# Altium project jetson_xavier_nx_board.PrjPcb (part 1 of 2)
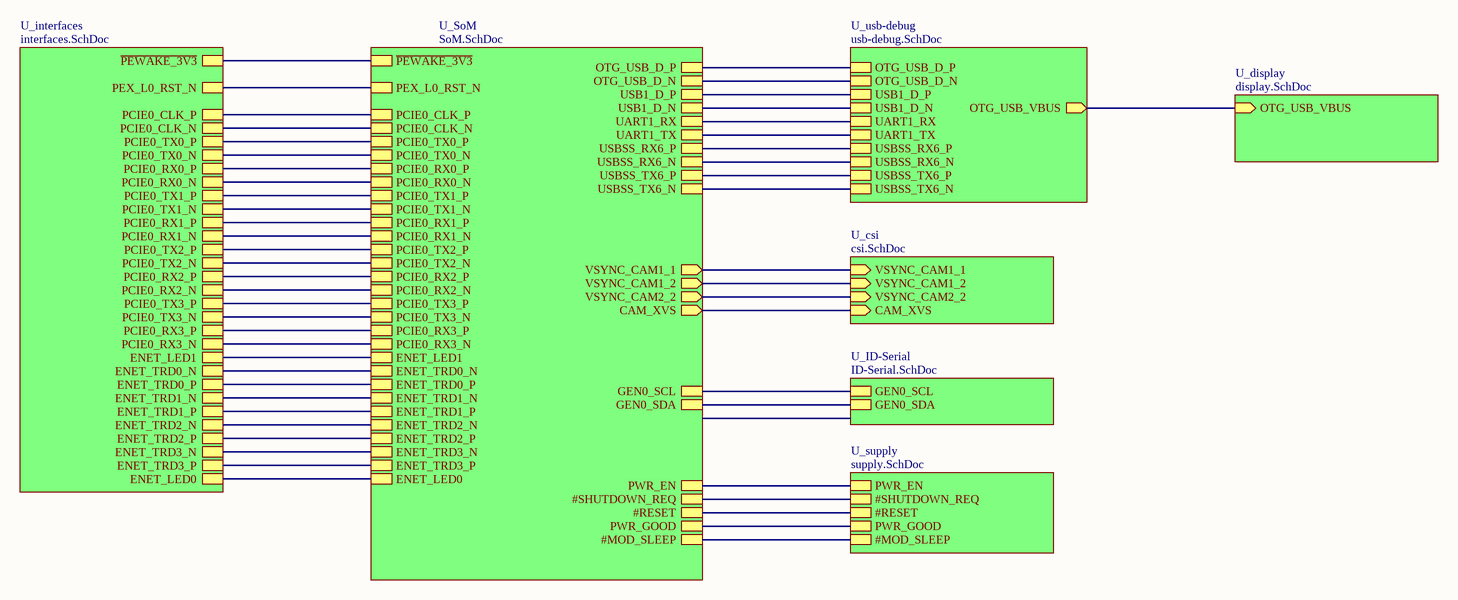
[diagram p0: top_sheet.SchDoc]
AM_Revision: 1.3; AM_Status: OSHW; AM_Title: Jetson Nano Baseboard
8 sheets, 347 parts. Net scope: hierarchical (ports join the sheet entries above them; power ports are global).
Board file: jetson_xavier_nx_board.PcbDoc
Sheets:
  top_sheet.SchDoc
    U_csi = csi.SchDoc
    U_ID-Serial = ID-Serial.SchDoc
    U_interfaces = interfaces.SchDoc
    U_SoM = SoM.SchDoc
    U_supply = supply.SchDoc
    U_usb-debug = usb-debug.SchDoc
    U_display = display.SchDoc

## Sheet top_sheet.SchDoc: Jetson Xavier NX Board
size A3; PageSetup: Record=PageOptions|CenterHorizontal=True|CenterVertical=True|PrintScale=0.97|XCorrection=1.00|YCorrection=1.00|PrintKind=1|BorderSize=5000000|LeftOffset=0|BottomOffset=0|Orientation=2|PaperLength=2970|PaperWidth=2100|Scale=100|PaperSource=7|PrintQuality=600|MediaType=1|DitherType=10|PaperKind=A4|PrintScaleMode=1; Organization: Altium Limited; Address1: 3 Minna Close; Address2: Belrose; Address3: NSW 2085; Address4: Australia; Revision: Rev01

### Sub-sheets
U_csi = csi.SchDoc: VSYNC_CAM1_1 (in), VSYNC_CAM1_2 (in), VSYNC_CAM2_2 (in), CAM_XVS (in)
U_display = display.SchDoc: OTG_USB_VBUS (in)
U_ID-Serial = ID-Serial.SchDoc: GEN0_SCL, GEN0_SDA
U_interfaces = interfaces.SchDoc: ~{PEWAKE_3V3}, PEX_L0_RST_N, PCIE0_CLK_P, PCIE0_CLK_N, PCIE0_TX0_P, PCIE0_TX0_N, PCIE0_RX0_P, PCIE0_RX0_N, PCIE0_TX1_P, PCIE0_TX1_N, PCIE0_RX1_P, PCIE0_RX1_N, PCIE0_TX2_P, PCIE0_TX2_N, PCIE0_RX2_P, PCIE0_RX2_N, PCIE0_TX3_P, PCIE0_TX3_N, PCIE0_RX3_P, PCIE0_RX3_N, ENET_LED1, ENET_TRD0_N, ENET_TRD0_P, ENET_TRD1_N, ENET_TRD1_P, ENET_TRD2_N, ENET_TRD2_P, ENET_TRD3_N, ENET_TRD3_P, ENET_LED0
U_SoM = SoM.SchDoc: VSYNC_CAM1_1 (out), VSYNC_CAM1_2 (out), VSYNC_CAM2_2 (out), ~{PEWAKE_3V3}, PEX_L0_RST_N, PCIE0_CLK_P, PCIE0_CLK_N, PCIE0_TX0_P, PCIE0_TX0_N, PCIE0_RX0_P, PCIE0_RX0_N, PCIE0_TX1_P, PCIE0_TX1_N, PCIE0_RX1_P, PCIE0_RX1_N, PCIE0_TX2_P, PCIE0_TX2_N, PCIE0_RX2_P, PCIE0_RX2_N, PCIE0_TX3_P, PCIE0_TX3_N, PCIE0_RX3_P, PCIE0_RX3_N, ENET_LED1, ENET_TRD0_N, ENET_TRD0_P, ENET_TRD1_N, ENET_TRD1_P, ENET_TRD2_N, ENET_TRD2_P, ENET_TRD3_N, ENET_TRD3_P, ENET_LED0, UART1_TX, UART1_RX, PWR_EN, #SHUTDOWN_REQ, #RESET, PWR_GOOD, USBSS_TX6_N, USBSS_TX6_P, USBSS_RX6_N, USBSS_RX6_P, #MOD_SLEEP, OTG_USB_D_N, OTG_USB_D_P, USB1_D_N, USB1_D_P, GEN0_SCL, GEN0_SDA, CAM_XVS (out)
U_supply = supply.SchDoc: PWR_EN, #SHUTDOWN_REQ, #RESET, PWR_GOOD, #MOD_SLEEP
U_usb-debug = usb-debug.SchDoc: OTG_USB_VBUS (out), USBSS_TX6_N, USBSS_TX6_P, USBSS_RX6_N, USBSS_RX6_P, UART1_TX, UART1_RX, OTG_USB_D_N, OTG_USB_D_P, USB1_D_N, USB1_D_P

### Nets
#MOD_SLEEP: sheet U_SoM/#MOD_SLEEP, sheet U_supply/#MOD_SLEEP
#RESET: sheet U_SoM/#RESET, sheet U_supply/#RESET
#SHUTDOWN_REQ: sheet U_SoM/#SHUTDOWN_REQ, sheet U_supply/#SHUTDOWN_REQ
~{PEWAKE_3V3}: sheet U_interfaces/~{PEWAKE_3V3}, sheet U_SoM/~{PEWAKE_3V3}
CAM_XVS: sheet U_csi/CAM_XVS, sheet U_SoM/CAM_XVS
ENET_LED0: sheet U_interfaces/ENET_LED0, sheet U_SoM/ENET_LED0
ENET_LED1: sheet U_interfaces/ENET_LED1, sheet U_SoM/ENET_LED1
ENET_TRD0_N: sheet U_interfaces/ENET_TRD0_N, sheet U_SoM/ENET_TRD0_N
ENET_TRD0_P: sheet U_interfaces/ENET_TRD0_P, sheet U_SoM/ENET_TRD0_P
ENET_TRD1_N: sheet U_interfaces/ENET_TRD1_N, sheet U_SoM/ENET_TRD1_N
ENET_TRD1_P: sheet U_interfaces/ENET_TRD1_P, sheet U_SoM/ENET_TRD1_P
ENET_TRD2_N: sheet U_interfaces/ENET_TRD2_N, sheet U_SoM/ENET_TRD2_N
ENET_TRD2_P: sheet U_interfaces/ENET_TRD2_P, sheet U_SoM/ENET_TRD2_P
ENET_TRD3_N: sheet U_interfaces/ENET_TRD3_N, sheet U_SoM/ENET_TRD3_N
ENET_TRD3_P: sheet U_interfaces/ENET_TRD3_P, sheet U_SoM/ENET_TRD3_P
GEN0_SCL: sheet U_ID-Serial/GEN0_SCL, sheet U_SoM/GEN0_SCL
GEN0_SDA: sheet U_ID-Serial/GEN0_SDA, sheet U_SoM/GEN0_SDA
OTG_USB_D_N: sheet U_SoM/OTG_USB_D_N, sheet U_usb-debug/OTG_USB_D_N
OTG_USB_D_P: sheet U_SoM/OTG_USB_D_P, sheet U_usb-debug/OTG_USB_D_P
OTG_USB_VBUS: sheet U_usb-debug/OTG_USB_VBUS, sheet U_display/OTG_USB_VBUS
PCIE0_CLK_N: sheet U_interfaces/PCIE0_CLK_N, sheet U_SoM/PCIE0_CLK_N
PCIE0_CLK_P: sheet U_interfaces/PCIE0_CLK_P, sheet U_SoM/PCIE0_CLK_P
PCIE0_RX0_N: sheet U_interfaces/PCIE0_RX0_N, sheet U_SoM/PCIE0_RX0_N
PCIE0_RX0_P: sheet U_interfaces/PCIE0_RX0_P, sheet U_SoM/PCIE0_RX0_P
PCIE0_RX1_N: sheet U_interfaces/PCIE0_RX1_N, sheet U_SoM/PCIE0_RX1_N
PCIE0_RX1_P: sheet U_interfaces/PCIE0_RX1_P, sheet U_SoM/PCIE0_RX1_P
PCIE0_RX2_N: sheet U_interfaces/PCIE0_RX2_N, sheet U_SoM/PCIE0_RX2_N
PCIE0_RX2_P: sheet U_interfaces/PCIE0_RX2_P, sheet U_SoM/PCIE0_RX2_P
PCIE0_RX3_N: sheet U_interfaces/PCIE0_RX3_N, sheet U_SoM/PCIE0_RX3_N
PCIE0_RX3_P: sheet U_interfaces/PCIE0_RX3_P, sheet U_SoM/PCIE0_RX3_P
PCIE0_TX0_N: sheet U_interfaces/PCIE0_TX0_N, sheet U_SoM/PCIE0_TX0_N
PCIE0_TX0_P: sheet U_interfaces/PCIE0_TX0_P, sheet U_SoM/PCIE0_TX0_P
PCIE0_TX1_N: sheet U_interfaces/PCIE0_TX1_N, sheet U_SoM/PCIE0_TX1_N
PCIE0_TX1_P: sheet U_interfaces/PCIE0_TX1_P, sheet U_SoM/PCIE0_TX1_P
PCIE0_TX2_N: sheet U_interfaces/PCIE0_TX2_N, sheet U_SoM/PCIE0_TX2_N
PCIE0_TX2_P: sheet U_interfaces/PCIE0_TX2_P, sheet U_SoM/PCIE0_TX2_P
PCIE0_TX3_N: sheet U_interfaces/PCIE0_TX3_N, sheet U_SoM/PCIE0_TX3_N
PCIE0_TX3_P: sheet U_interfaces/PCIE0_TX3_P, sheet U_SoM/PCIE0_TX3_P
PEX_L0_RST_N: sheet U_interfaces/PEX_L0_RST_N, sheet U_SoM/PEX_L0_RST_N
PWR_EN: sheet U_SoM/PWR_EN, sheet U_supply/PWR_EN
PWR_GOOD: sheet U_SoM/PWR_GOOD, sheet U_supply/PWR_GOOD
UART1_RX: sheet U_SoM/UART1_RX, sheet U_usb-debug/UART1_RX
UART1_TX: sheet U_SoM/UART1_TX, sheet U_usb-debug/UART1_TX
USB1_D_N: sheet U_SoM/USB1_D_N, sheet U_usb-debug/USB1_D_N
USB1_D_P: sheet U_SoM/USB1_D_P, sheet U_usb-debug/USB1_D_P
USBSS_RX6_N: sheet U_SoM/USBSS_RX6_N, sheet U_usb-debug/USBSS_RX6_N
USBSS_RX6_P: sheet U_SoM/USBSS_RX6_P, sheet U_usb-debug/USBSS_RX6_P
USBSS_TX6_N: sheet U_SoM/USBSS_TX6_N, sheet U_usb-debug/USBSS_TX6_N
USBSS_TX6_P: sheet U_SoM/USBSS_TX6_P, sheet U_usb-debug/USBSS_TX6_P
VSYNC_CAM1_1: sheet U_csi/VSYNC_CAM1_1, sheet U_SoM/VSYNC_CAM1_1
VSYNC_CAM1_2: sheet U_csi/VSYNC_CAM1_2, sheet U_SoM/VSYNC_CAM1_2
VSYNC_CAM2_2: sheet U_csi/VSYNC_CAM2_2, sheet U_SoM/VSYNC_CAM2_2

### Notes on the sheet
- Title
- Size:
- Date:
- A3
- Number:
- Time:
- Revision:
- Sheet
- of
- Go360.io
- File:

## Sheet csi.SchDoc: Jetson Xavier NX Board
size A3; PageSetup: Record=PageOptions|CenterHorizontal=True|CenterVertical=True|PrintScale=0.97|XCorrection=1.00|YCorrection=1.00|PrintKind=1|BorderSize=5000000|LeftOffset=0|BottomOffset=0|Orientation=2|PaperLength=2970|PaperWidth=2100|Scale=100|PaperSource=7|PrintQuality=600|MediaType=1|DitherType=10|PaperKind=A4|PrintScaleMode=1; Organization: Altium Limited; Address1: 3 Minna Close; Address2: Belrose; Address3: NSW 2085; Address4: Australia; Revision: Rev01
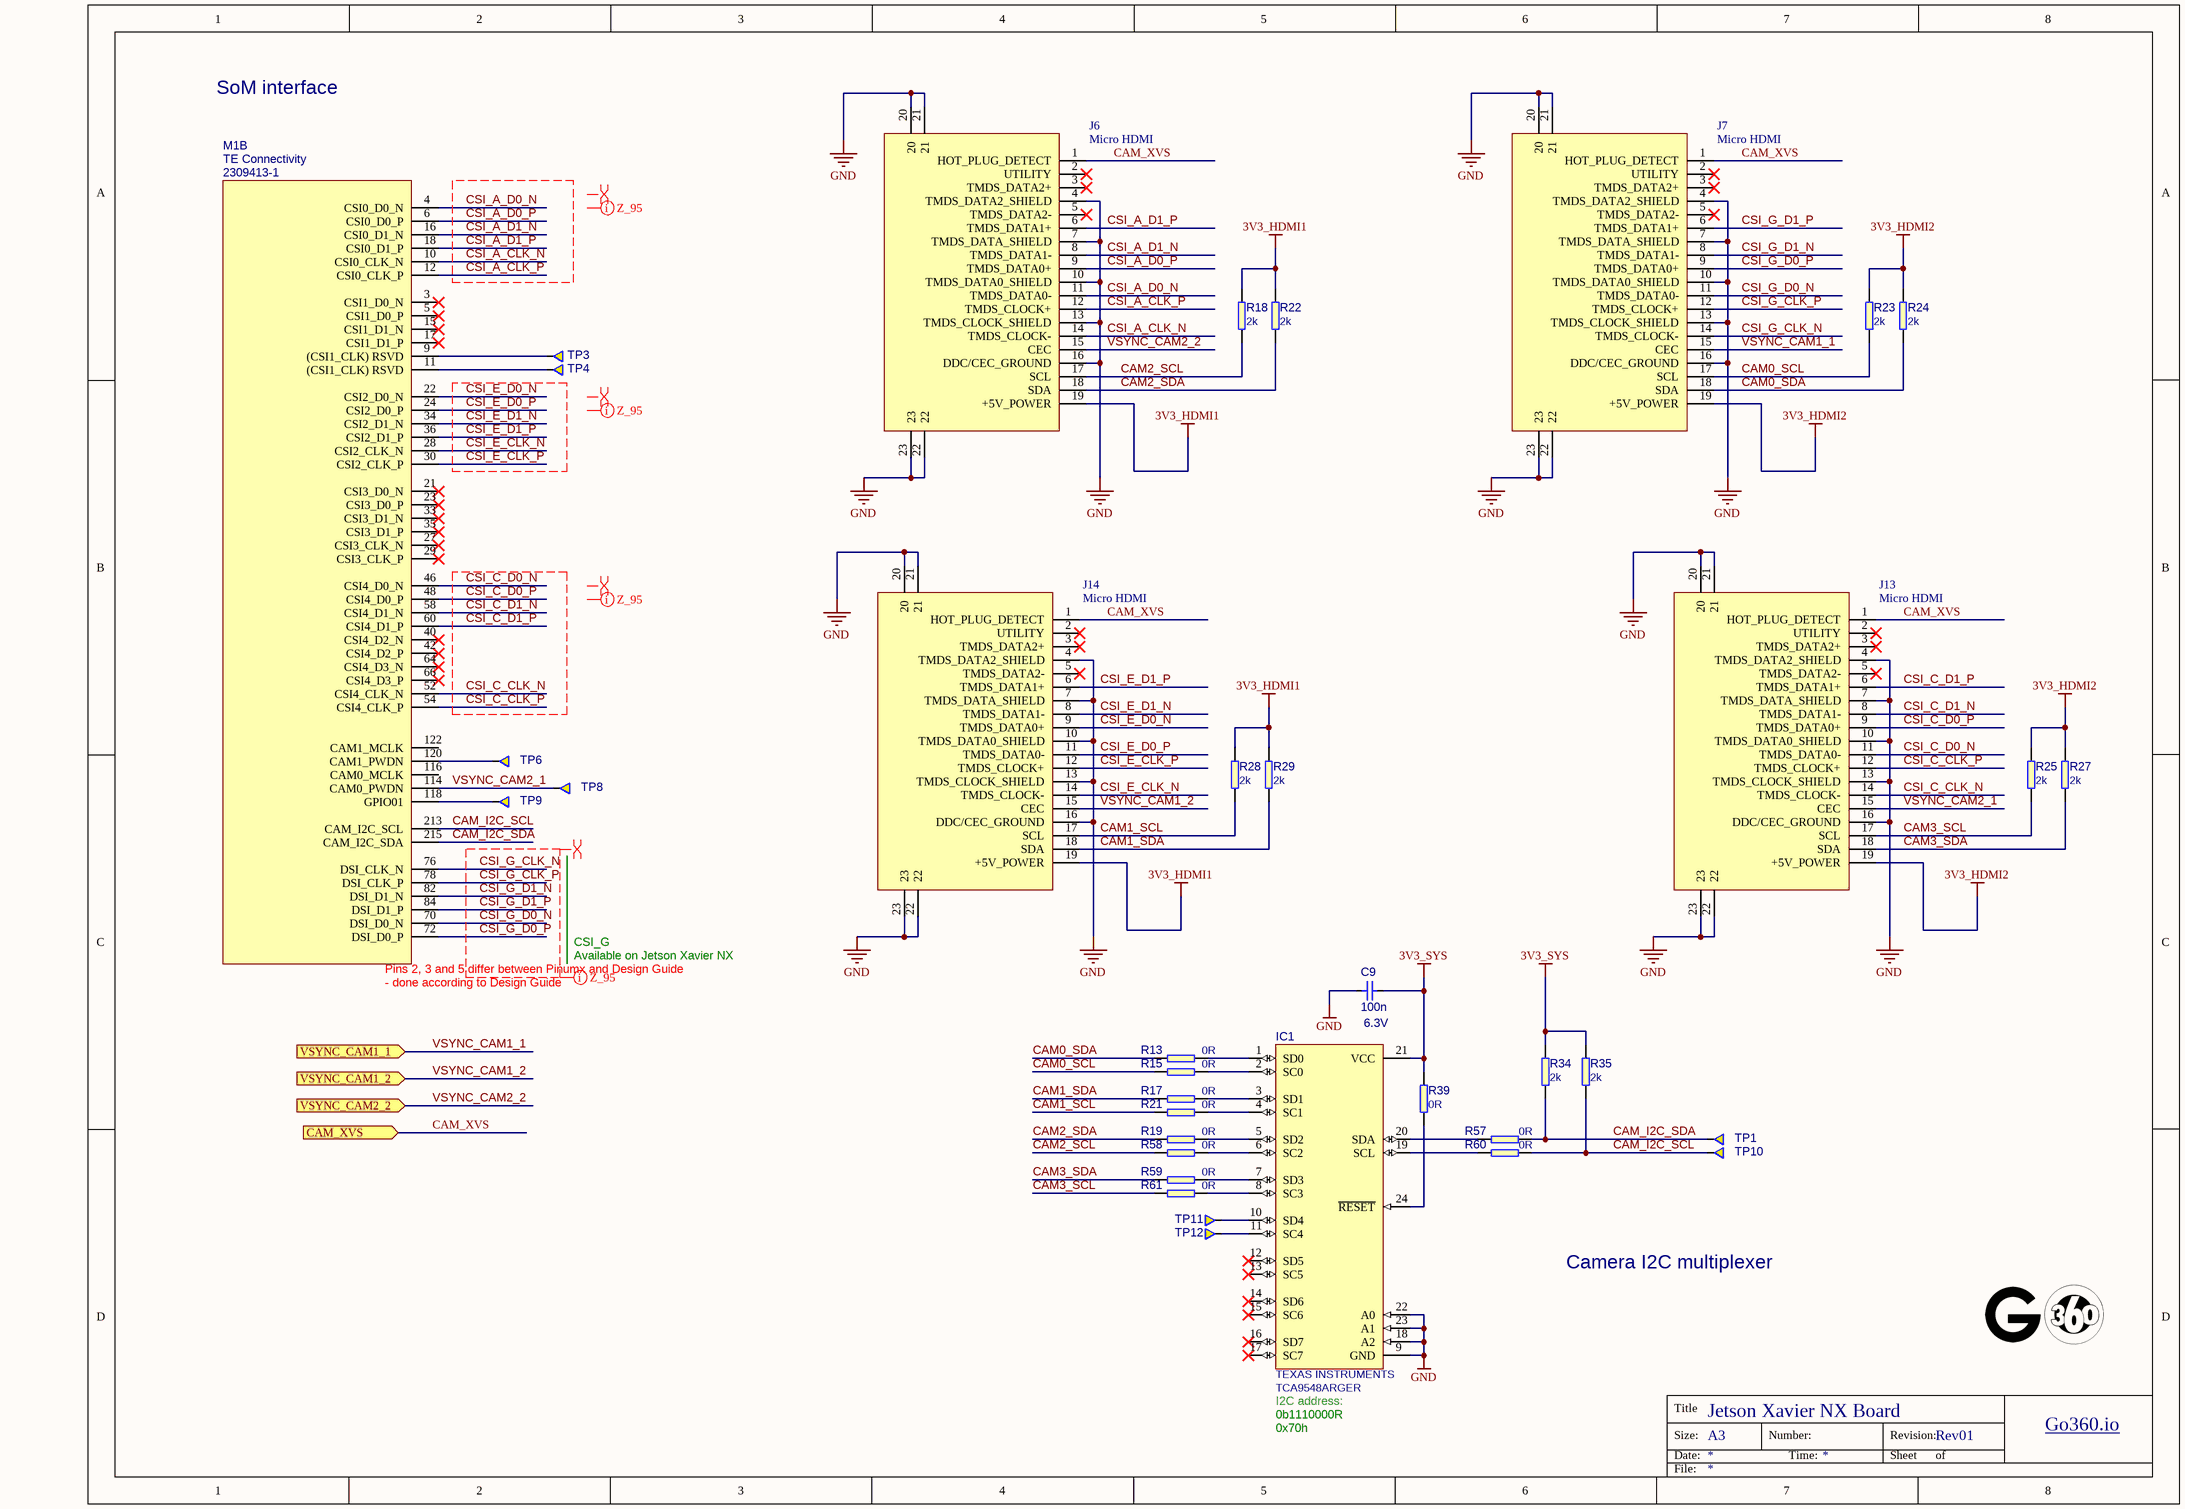
[diagram p1: csi.SchDoc]

### Parts
(Parts that share a designator on the sheet are numbered #1, #2 ... from top to bottom, then left to right.)
C9  Voltage: 6.3V  [0402]  (hidden comment: 100n)
IC1  TCA9548ARGER  Manufacturer: TEXAS INSTRUMENTS  [VQFN-24]
J6  Micro HDMI  [HDMI-0467650301]
J7  Micro HDMI  [HDMI-0467650301]
J13  Micro HDMI  [HDMI-0467650301]
J14  Micro HDMI  [HDMI-0467650301]
M1#1  Manufacturer: TE Connectivity  [jetson-nano-connector]  (hidden comment: 2309413-1)  (part B of 7)
R13  0R  [0402]
R15  0R  [0402]
R17  0R  [0402]
R18  2k  [0402]
R19  0R  [0402]
R21  0R  [0402]
R22  2k  [0402]
R23  2k  [0402]
R24  2k  [0402]
R25  2k  [0402]
R27  2k  [0402]
R28  2k  [0402]
R29  2k  [0402]
R34  2k  [0402]
R35  2k  [0402]
R39  0R  [0402]
R57  0R  [0402]
R58  0R  [0402]
R59  0R  [0402]
R60  0R  [0402]
R61  0R  [0402]
TP1  Testpad  [TP-R-1.5]  (value not drawn)  (no BOM)
TP3  Testpad  [TP-R-1.5]  (value not drawn)  (no BOM)
TP4  Testpad  [TP-R-1.5]  (value not drawn)  (no BOM)
TP6  Testpad  [TP-R-1.5]  (value not drawn)  (no BOM)
TP8  Testpad  [TP-R-1.5]  (value not drawn)  (no BOM)
TP9  Testpad  [TP-R-1.5]  (value not drawn)  (no BOM)
TP10  Testpad  [TP-R-1.5]  (value not drawn)  (no BOM)
TP11  Testpad  [TP-R-1.5]  (value not drawn)  (no BOM)
TP12  Testpad  [TP-R-1.5]  (value not drawn)  (no BOM)

### Ports
CAM_XVS (in), VSYNC_CAM1_1 (in), VSYNC_CAM1_2 (in), VSYNC_CAM2_2 (in)

### Nets
3V3_HDMI1: J6.19(+5V_POWER) J14.19(+5V_POWER) R18.1 R22.1 R28.1 R29.1
3V3_HDMI2: J7.19(+5V_POWER) J13.19(+5V_POWER) R23.1 R24.1 R25.1 R27.1
3V3_SYS: C9.2 IC1.21(VCC) R34.1 R35.1 R39.2
GND: C9.1 IC1.9(GND) IC1.18(A2) IC1.22(A0) IC1.23(A1) J6.4(TMDS_DATA2_SHIELD) J6.7(TMDS_DATA_SHIELD) J6.10(TMDS_DATA0_SHIELD) J6.13(TMDS_CLOCK_SHIELD) J6.16(DDC/CEC_GROUND) J6.20 J6.21 J6.22 J6.23 J7.4(TMDS_DATA2_SHIELD) J7.7(TMDS_DATA_SHIELD) J7.10(TMDS_DATA0_SHIELD) J7.13(TMDS_CLOCK_SHIELD) J7.16(DDC/CEC_GROUND) J7.20 J7.21 J7.22 J7.23 J13.4(TMDS_DATA2_SHIELD) J13.7(TMDS_DATA_SHIELD) J13.10(TMDS_DATA0_SHIELD) J13.13(TMDS_CLOCK_SHIELD) J13.16(DDC/CEC_GROUND) J13.20 J13.21 J13.22 J13.23 J14.4(TMDS_DATA2_SHIELD) J14.7(TMDS_DATA_SHIELD) J14.10(TMDS_DATA0_SHIELD) J14.13(TMDS_CLOCK_SHIELD) J14.16(DDC/CEC_GROUND) J14.20 J14.21 J14.22 J14.23
CAM0_SCL: J7.17(SCL) R15.1 R23.2
CAM0_SDA: J7.18(SDA) R13.1 R24.2
CAM1_SCL: J14.17(SCL) R21.1 R28.2
CAM1_SDA: J14.18(SDA) R17.1 R29.2
CAM2_SCL: J6.17(SCL) R18.2 R58.1
CAM2_SDA: J6.18(SDA) R19.1 R22.2
CAM3_SCL: J13.17(SCL) R25.2 R61.1
CAM3_SDA: J13.18(SDA) R27.2 R59.1
CAM_I2C_SCL: M1#1.213(CAM_I2C_SCL) R35.2 R60.2 TP10.1
CAM_I2C_SDA: M1#1.215(CAM_I2C_SDA) R34.2 R57.2 TP1.1
CAM_XVS: J6.1(HOT_PLUG_DETECT) J7.1(HOT_PLUG_DETECT) J13.1(HOT_PLUG_DETECT) J14.1(HOT_PLUG_DETECT) ; port CAM_XVS
CSI_A_CLK_N: J6.14(TMDS_CLOCK-) M1#1.10(CSI0_CLK_N)
CSI_A_CLK_P: J6.12(TMDS_CLOCK+) M1#1.12(CSI0_CLK_P)
CSI_A_D0_N: J6.11(TMDS_DATA0-) M1#1.4(CSI0_D0_N)
CSI_A_D0_P: J6.9(TMDS_DATA0+) M1#1.6(CSI0_D0_P)
CSI_A_D1_N: J6.8(TMDS_DATA1-) M1#1.16(CSI0_D1_N)
CSI_A_D1_P: J6.6(TMDS_DATA1+) M1#1.18(CSI0_D1_P)
CSI_C_CLK_N: J13.14(TMDS_CLOCK-) M1#1.52(CSI4_CLK_N)
CSI_C_CLK_P: J13.12(TMDS_CLOCK+) M1#1.54(CSI4_CLK_P)
CSI_C_D0_N: J13.11(TMDS_DATA0-) M1#1.46(CSI4_D0_N)
CSI_C_D0_P: J13.9(TMDS_DATA0+) M1#1.48(CSI4_D0_P)
CSI_C_D1_N: J13.8(TMDS_DATA1-) M1#1.58(CSI4_D1_N)
CSI_C_D1_P: J13.6(TMDS_DATA1+) M1#1.60(CSI4_D1_P)
CSI_E_CLK_N: J14.14(TMDS_CLOCK-) M1#1.28(CSI2_CLK_N)
CSI_E_CLK_P: J14.12(TMDS_CLOCK+) M1#1.30(CSI2_CLK_P)
CSI_E_D0_N: J14.9(TMDS_DATA0+) M1#1.22(CSI2_D0_N)
CSI_E_D0_P: J14.11(TMDS_DATA0-) M1#1.24(CSI2_D0_P)
CSI_E_D1_N: J14.8(TMDS_DATA1-) M1#1.34(CSI2_D1_N)
CSI_E_D1_P: J14.6(TMDS_DATA1+) M1#1.36(CSI2_D1_P)
CSI_G_CLK_N: J7.14(TMDS_CLOCK-) M1#1.76(DSI_CLK_N)
CSI_G_CLK_P: J7.12(TMDS_CLOCK+) M1#1.78(DSI_CLK_P)
CSI_G_D0_N: J7.11(TMDS_DATA0-) M1#1.70(DSI_D0_N)
CSI_G_D0_P: J7.9(TMDS_DATA0+) M1#1.72(DSI_D0_P)
CSI_G_D1_N: J7.8(TMDS_DATA1-) M1#1.82(DSI_D1_N)
CSI_G_D1_P: J7.6(TMDS_DATA1+) M1#1.84(DSI_D1_P)
VSYNC_CAM1_1: J7.15(CEC) ; port VSYNC_CAM1_1
VSYNC_CAM1_2: J14.15(CEC) ; port VSYNC_CAM1_2
VSYNC_CAM2_1: J13.15(CEC) M1#1.114(CAM0_PWDN) TP8.1
VSYNC_CAM2_2: J6.15(CEC) ; port VSYNC_CAM2_2
NetIC1_1: IC1.1(SD0) R13.2
NetIC1_2: IC1.2(SC0) R15.2
NetIC1_3: IC1.3(SD1) R17.2
NetIC1_4: IC1.4(SC1) R21.2
NetIC1_5: IC1.5(SD2) R19.2
NetIC1_6: IC1.6(SC2) R58.2
NetIC1_7: IC1.7(SD3) R59.2
NetIC1_8: IC1.8(SC3) R61.2
NetIC1_10: IC1.10(SD4) TP11.1
NetIC1_11: IC1.11(SC4) TP12.1
NetIC1_19: IC1.19(SCL) R60.1
NetIC1_20: IC1.20(SDA) R57.1
NetIC1_24: IC1.24(~{RESET}) R39.1
NetM1#1_9: M1#1.9((CSI1_CLK)_RSVD) TP3.1
NetM1#1_11: M1#1.11((CSI1_CLK)_RSVD) TP4.1
NetM1#1_118: M1#1.118(GPIO01) TP9.1
NetM1#1_120: M1#1.120(CAM1_PWDN) TP6.1

Not connected (* = marked no-connect by the designer): IC1 12(SD5)* 13(SC5)* 14(SD6)* 15(SC6)* 16(SD7)* 17(SC7)*; J6 2(UTILITY)* 3(TMDS_DATA2+)* 5(TMDS_DATA2-)*; J7 2(UTILITY)* 3(TMDS_DATA2+)* 5(TMDS_DATA2-)*; J13 2(UTILITY)* 3(TMDS_DATA2+)* 5(TMDS_DATA2-)*; J14 2(UTILITY)* 3(TMDS_DATA2+)* 5(TMDS_DATA2-)*; M1#1 3(CSI1_D0_N)* 5(CSI1_D0_P)* 15(CSI1_D1_N)* 17(CSI1_D1_P)* 21(CSI3_D0_N)* 23(CSI3_D0_P)* 27(CSI3_CLK_N)* 29(CSI3_CLK_P)* 33(CSI3_D1_N)* 35(CSI3_D1_P)* 40(CSI4_D2_N)* 42(CSI4_D2_P)* 64(CSI4_D3_N)* 66(CSI4_D3_P)* 116(CAM0_MCLK) 122(CAM1_MCLK)

### Layout directives
differential pair: (no net found under the mark), CSI_G_CLK_N, CSI_G_CLK_P, CSI_G_D0_N, CSI_G_D0_P, CSI_G_D1_N, CSI_G_D1_P
net class Z_95: (no net found under the mark), CSI_G_CLK_N, CSI_G_CLK_P, CSI_G_D0_N, CSI_G_D0_P, CSI_G_D1_N, CSI_G_D1_P

### Notes on the sheet
- SoM interface
- CSI_G
- Available on Jetson Xavier NX
- Camera I2C multiplexer
- 0x70h
- 0b1110000R
- (near IC1) I2C address:
- Title
- Size:
- Date:
- A3
- Number:
- Time:
- Revision:
- Sheet
- of
- Go360.io
- File:
- (in symbol jetson-nano-new-release, part B) Pins 2, 3 and 5 differ between Pinumx and Design Guide; - done according to Design Guide

### Library data of the parts
C9 = C_100n_0402: MLCC SMT Capacitor 100n 0402; Manufacturer: TDK; PartSymbol: C1005X5R0J104K050BA; Value: 100n; PartNumber: C_100n_0402
IC1 = TCA9548A: TCA9548ARGER  I2C SWITCH W/ RESET, 8-CH, VQFN-24; Value: TCA9548ARGER; PartNumber: TCA9548ARGER; PartSymbol: TCA9548ARGER
J6 J7 J13 J14 = HDMI-0467650301
M1#1 = jetson-nano-new-release: PartNumber: 2309413-1; PartSymbol: 2309413-1; Value: 2309413-1
R13 R15 R17 R19 R21 R39 R57-R61 = R_0R_0402: RES, 0R, 0402; Manufacturer: Panasonic; PartSymbol: ERJ2GE0R00X; Value: 0R; PartNumber: R_0R_0402
R18 R22-R25 R27-R29 R34 R35 = R_2k_0402: RES, 2k, 0402; Manufacturer: VISHAY; PartSymbol: CRCW04022K00FKED; PartNumber: R_2k_0402; Value: 2k
TP1 TP3 TP4 TP6 TP8-TP12 = Testpad: Testpad, round, 1.5mm; PartNumber: TP-R-1.5

## Sheet ID-Serial.SchDoc: Jetson Xavier NX Board
size A3; PageSetup: Record=PageOptions|CenterHorizontal=True|CenterVertical=True|PrintScale=0.97|XCorrection=1.00|YCorrection=1.00|PrintKind=1|BorderSize=5000000|LeftOffset=0|BottomOffset=0|Orientation=2|PaperLength=2970|PaperWidth=2100|Scale=100|PaperSource=7|PrintQuality=600|MediaType=1|DitherType=10|PaperKind=A4|PrintScaleMode=1; Organization: Altium Limited; Address1: 3 Minna Close; Address2: Belrose; Address3: NSW 2085; Address4: Australia; Revision: Rev01
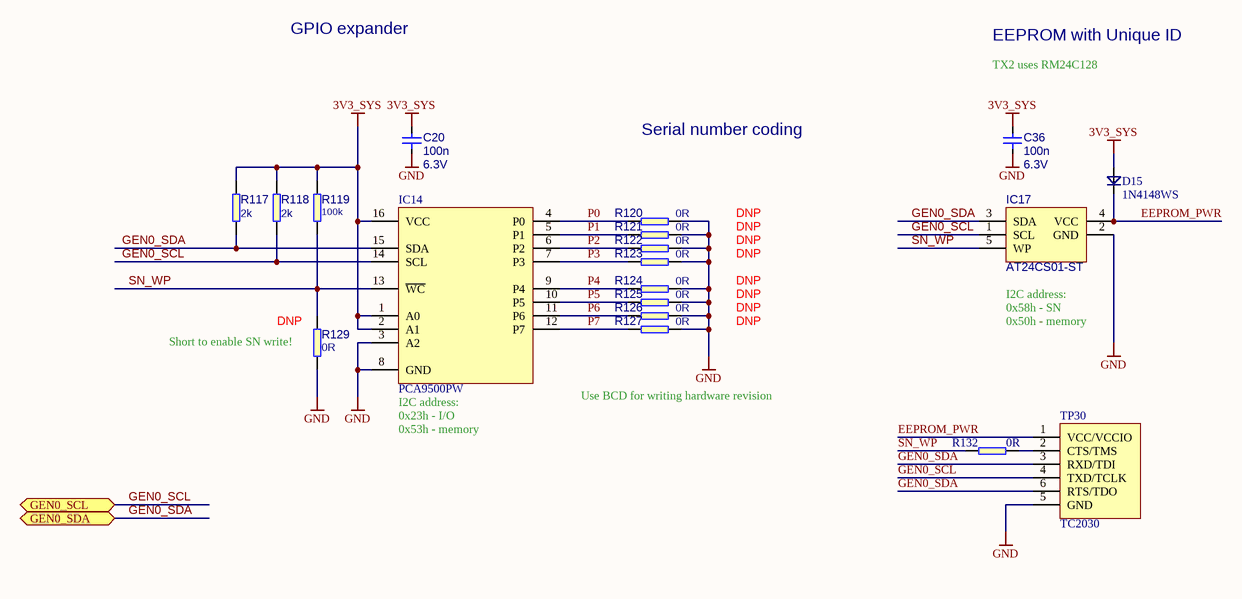
[diagram p2: ID-Serial.SchDoc]

### Parts
C20  Voltage: 6.3V  [0402]  (hidden comment: 100n)
C36  Voltage: 6.3V  [0402]  (hidden comment: 100n)
D15  1N4148WS  [SOD-323]
IC14  PCA9500PW  [TSSOP-16]
IC17  AT24CS01-ST  [SOT23-5]
R117  2k  [0402]
R118  2k  [0402]
R119  100k  [0402]
R120  0R  [0402]
R121  0R  [0402]
R122  0R  [0402]
R123  0R  [0402]
R124  0R  [0402]
R125  0R  [0402]
R126  0R  [0402]
R127  0R  [0402]
R129  0R  [0402]
R132  0R  [0402]
TP30  TC2030  [TC2030]  (no BOM)

### Ports
GEN0_SCL, GEN0_SDA

### Nets
3V3_SYS: C20.2 C36.2 D15.A IC14.1(A0) IC14.2(A1) IC14.16(VCC) R117.1 R118.1 R119.1
GND: C20.1 C36.1 IC14.3(A2) IC14.8(GND) IC17.2(GND) R120.2 R121.2 R122.2 R123.2 R124.2 R125.2 R126.2 R127.2 R129.1 TP30.5(GND)
EEPROM_PWR: D15.C IC17.4(VCC) TP30.1(VCC/VCCIO)
GEN0_SCL: IC14.14(SCL) IC17.1(SCL) R118.2 TP30.4(TXD/TCLK) ; port GEN0_SCL
GEN0_SDA: IC14.15(SDA) IC17.3(SDA) R117.2 TP30.3(RXD/TDI) TP30.6(RTS/TDO) ; port GEN0_SDA
P0: IC14.4(P0) R120.1
P1: IC14.5(P1) R121.1
P2: IC14.6(P2) R122.1
P3: IC14.7(P3) R123.1
P4: IC14.9(P4) R124.1
P5: IC14.10(P5) R125.1
P6: IC14.11(P6) R126.1
P7: IC14.12(P7) R127.1
SN_WP: IC14.13(~{WC}) IC17.5(WP) R119.2 R129.2 R132.1
NetR132_2: R132.2 TP30.2(CTS/TMS)

### Notes on the sheet
- GPIO expander
- EEPROM with Unique ID
- TX2 uses RM24C128
- Serial number coding
- DNP
- (near IC17) I2C address:
- (near R129) Short to enable SN write!
- (near R129) DNP
- 0x58h - SN
- 0x50h - memory
- (near IC14) 0x23h - I/O
- (near IC14) I2C address:
- 0x53h - memory
- Use BCD for writing hardware revision
- Title
- Size:
- Date:
- A3
- Number:
- Time:
- Revision:
- Sheet
- of
- Go360.io
- File:

### Library data of the parts
C20 C36 = C_100n_0402: as C9 on sheet csi; Value: 100n; PartNumber: C_100n_0402
D15 = diode: Diode small signal; Manufacturer: ON SEMICONDUCTOR; PartNumber: 1N4148WS; Value: 1N4148WS; PartSymbol: 1N4148WS
IC14 = PCA9500PW: Remote 8bit I2C SMBus I/O expander w/ 2kbit EEPROM memory; Manufacturer: NXP Semicondutors; PartNumber: PCA9500PW; Value: PCA9500PW; PartSymbol: PCA9500PW
IC17 = AT24CS01: Manufacturer: Atmel; PartNumber: AT24CS01-ST; PartSymbol: AT24CS01-ST; Value: AT24CS01-ST
R117 R118 = R_2k_0402: as R18 on sheet csi; PartNumber: R_2k_0402; Value: 2k
R119 = R_100k_0402: SMT Resistor 100k 0402; Manufacturer: VISHAY; PartSymbol: CRCW0402100KFKEDHP; Tolerance: 1%; PartNumber: R_100k_0402; Value: 100k
R120-R127 R129 R132 = R_0R_0402: as R13 on sheet csi; PartNumber: R_0R_0402; Value: 0R
TP30 = TC2030: Manufacturer: Tag-Connect; PartNumber: TC2030; PartSymbol: TC2030; Value: TC2030

## Sheet interfaces.SchDoc: Jetson Xavier NX Board
size A3; PageSetup: Record=PageOptions|CenterHorizontal=True|CenterVertical=True|PrintScale=0.97|XCorrection=1.00|YCorrection=1.00|PrintKind=1|BorderSize=5000000|LeftOffset=0|BottomOffset=0|Orientation=2|PaperLength=2970|PaperWidth=2100|Scale=100|PaperSource=7|PrintQuality=600|MediaType=1|DitherType=10|PaperKind=A4|PrintScaleMode=1; Organization: Altium Limited; Address1: 3 Minna Close; Address2: Belrose; Address3: NSW 2085; Address4: Australia; Revision: Rev01
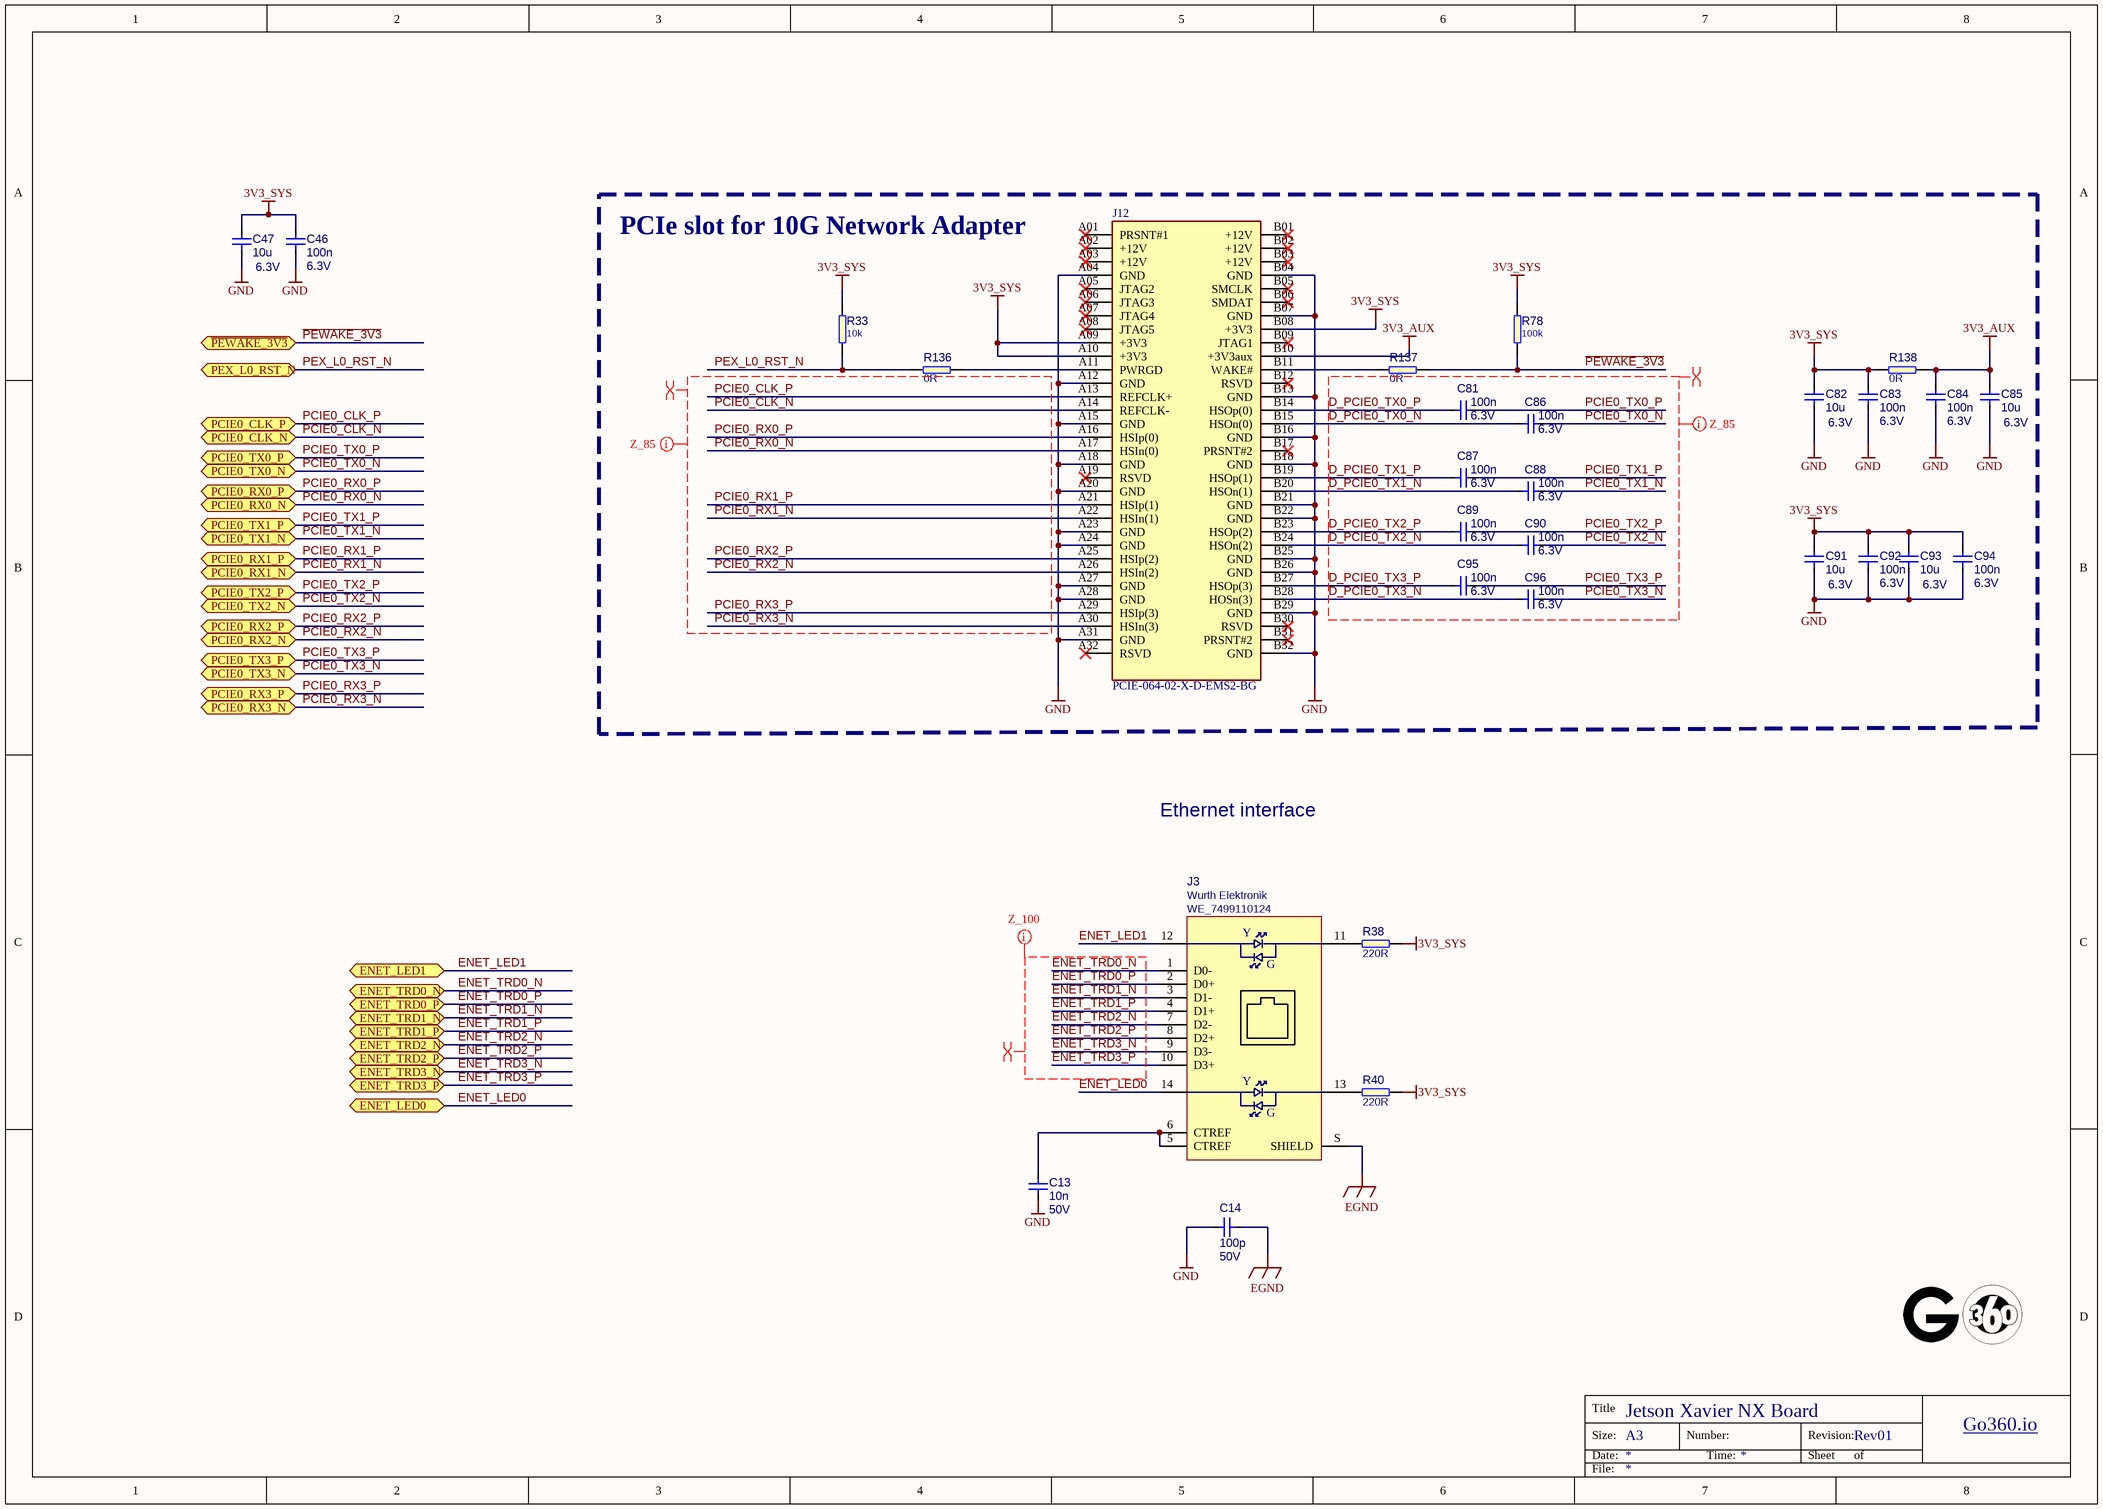
[diagram p3: interfaces.SchDoc]

### Parts
C13  Voltage: 50V  [0402]  (hidden comment: 10n)
C14  Voltage: 50V  [0805]  (hidden comment: 100p)
C46  Voltage: 6.3V  [0402]  (hidden comment: 100n)
C47  Voltage: 6.3V  [0603]  (hidden comment: 10u)
C81  Voltage: 6.3V  [0402]  (hidden comment: 100n)
C82  Voltage: 6.3V  [0603]  (hidden comment: 10u)
C83  Voltage: 6.3V  [0402]  (hidden comment: 100n)
C84  Voltage: 6.3V  [0402]  (hidden comment: 100n)
C85  Voltage: 6.3V  [0603]  (hidden comment: 10u)
C86  Voltage: 6.3V  [0402]  (hidden comment: 100n)
C87  Voltage: 6.3V  [0402]  (hidden comment: 100n)
C88  Voltage: 6.3V  [0402]  (hidden comment: 100n)
C89  Voltage: 6.3V  [0402]  (hidden comment: 100n)
C90  Voltage: 6.3V  [0402]  (hidden comment: 100n)
C91  Voltage: 6.3V  [0603]  (hidden comment: 10u)
C92  Voltage: 6.3V  [0402]  (hidden comment: 100n)
C93  Voltage: 6.3V  [0603]  (hidden comment: 10u)
C94  Voltage: 6.3V  [0402]  (hidden comment: 100n)
C95  Voltage: 6.3V  [0402]  (hidden comment: 100n)
C96  Voltage: 6.3V  [0402]  (hidden comment: 100n)
J3  Manufacturer: Wurth Elektronik  [WE_7499110124]  (hidden comment: WE_7499110124)
J12  PCIE-064-02-X-D-EMS2-BG  [SAMTEC_PCIE-064-02-X-D-EMS2-BG]
R33  10k  [0402]
R38  220R  [0402]
R40  220R  [0402]
R78  100k  [0402]
R136  0R  [0402]
R137  0R  [0402]
R138  0R  [0402]

### Blocks framed on the sheet
PCIe slot for 10G Network Adapter: C81-C96 J12 R33 R78 R136-R138

### Ports
ENET_LED0, ENET_LED1, ENET_TRD0_N, ENET_TRD0_P, ENET_TRD1_N, ENET_TRD1_P, ENET_TRD2_N, ENET_TRD2_P, ENET_TRD3_N, ENET_TRD3_P, PCIE0_CLK_N, PCIE0_CLK_P, PCIE0_RX0_N, PCIE0_RX0_P, PCIE0_RX1_N, PCIE0_RX1_P, PCIE0_RX2_N, PCIE0_RX2_P, PCIE0_RX3_N, PCIE0_RX3_P, PCIE0_TX0_N, PCIE0_TX0_P, PCIE0_TX1_N, PCIE0_TX1_P, PCIE0_TX2_N, PCIE0_TX2_P, PCIE0_TX3_N, PCIE0_TX3_P, PEX_L0_RST_N, ~{PEWAKE_3V3}

### Nets
3V3_AUX: C84.2 C85.2 J12.B10(+3V3aux) R138.1
3V3_SYS: C46.2 C47.2 C82.2 C83.2 C91.2 C92.2 C93.2 C94.2 J12.A09(+3V3) J12.A10(+3V3) J12.B08(+3V3) R33.1 R38.2 R40.1 R78.2 R138.2
EGND: C14.1 J3.S(SHIELD)
GND: C13.2 C14.2 C46.1 C47.1 C82.1 C83.1 C84.1 C85.1 C91.1 C92.1 C93.1 C94.1 J12.A04(GND) J12.A12(GND) J12.A15(GND) J12.A18(GND) J12.A20(GND) J12.A23(GND) J12.A24(GND) J12.A27(GND) J12.A28(GND) J12.A31(GND) J12.B04(GND) J12.B07(GND) J12.B13(GND) J12.B16(GND) J12.B18(GND) J12.B21(GND) J12.B22(GND) J12.B25(GND) J12.B26(GND) J12.B29(GND) J12.B32(GND)
~{PEWAKE_3V3}: R78.1 R137.1 ; port ~{PEWAKE_3V3}
D_PCIE0_TX0_N: C86.1 J12.B15(HSOn(0))
D_PCIE0_TX0_P: C81.1 J12.B14(HSOp(0))
D_PCIE0_TX1_N: C88.1 J12.B20(HSOn(1))
D_PCIE0_TX1_P: C87.1 J12.B19(HSOp(1))
D_PCIE0_TX2_N: C90.1 J12.B24(HSOn(2))
D_PCIE0_TX2_P: C89.1 J12.B23(HSOp(2))
D_PCIE0_TX3_N: C96.1 J12.B28(HOSn(3))
D_PCIE0_TX3_P: C95.1 J12.B27(HSOp(3))
ENET_LED0: J3.14 ; port ENET_LED0
ENET_LED1: J3.12 ; port ENET_LED1
ENET_TRD0_N: J3.1(D0-) ; port ENET_TRD0_N
ENET_TRD0_P: J3.2(D0+) ; port ENET_TRD0_P
ENET_TRD1_N: J3.3(D1-) ; port ENET_TRD1_N
ENET_TRD1_P: J3.4(D1+) ; port ENET_TRD1_P
ENET_TRD2_N: J3.7(D2-) ; port ENET_TRD2_N
ENET_TRD2_P: J3.8(D2+) ; port ENET_TRD2_P
ENET_TRD3_N: J3.9(D3-) ; port ENET_TRD3_N
ENET_TRD3_P: J3.10(D3+) ; port ENET_TRD3_P
PCIE0_CLK_N: J12.A14(REFCLK-) ; port PCIE0_CLK_N
PCIE0_CLK_P: J12.A13(REFCLK+) ; port PCIE0_CLK_P
PCIE0_RX0_N: J12.A17(HSIn(0)) ; port PCIE0_RX0_N
PCIE0_RX0_P: J12.A16(HSIp(0)) ; port PCIE0_RX0_P
PCIE0_RX1_N: J12.A22(HSIn(1)) ; port PCIE0_RX1_N
PCIE0_RX1_P: J12.A21(HSIp(1)) ; port PCIE0_RX1_P
PCIE0_RX2_N: J12.A26(HSIn(2)) ; port PCIE0_RX2_N
PCIE0_RX2_P: J12.A25(HSIp(2)) ; port PCIE0_RX2_P
PCIE0_RX3_N: J12.A30(HSIn(3)) ; port PCIE0_RX3_N
PCIE0_RX3_P: J12.A29(HSIp(3)) ; port PCIE0_RX3_P
PCIE0_TX0_N: C86.2 ; port PCIE0_TX0_N
PCIE0_TX0_P: C81.2 ; port PCIE0_TX0_P
PCIE0_TX1_N: C88.2 ; port PCIE0_TX1_N
PCIE0_TX1_P: C87.2 ; port PCIE0_TX1_P
PCIE0_TX2_N: C90.2 ; port PCIE0_TX2_N
PCIE0_TX2_P: C89.2 ; port PCIE0_TX2_P
PCIE0_TX3_N: C96.2 ; port PCIE0_TX3_N
PCIE0_TX3_P: C95.2 ; port PCIE0_TX3_P
PEX_L0_RST_N: R33.2 R136.2 ; port PEX_L0_RST_N
NetC13_1: C13.1 J3.5(CTREF) J3.6(CTREF)
NetJ3_11: J3.11 R38.1
NetJ3_13: J3.13 R40.2
NetJ12_A11: J12.A11(PWRGD) R136.1
NetJ12_B11: J12.B11(WAKE#) R137.2

Not connected (* = marked no-connect by the designer): J12 A01(PRSNT#1)* A02(+12V)* A03(+12V)* A05(JTAG2)* A06(JTAG3)* A07(JTAG4)* A08(JTAG5)* A19(RSVD)* A32(RSVD)* B01(+12V)* B02(+12V)* B03(+12V)* B05(SMCLK)* B06(SMDAT)* B09(JTAG1)* B12(RSVD)* B17(PRSNT#2)* B30(RSVD)* B31(PRSNT#2)*

### Layout directives
net class Z_100: ENET_TRD0_N, ENET_TRD0_P, ENET_TRD1_N, ENET_TRD1_P, ENET_TRD2_N, ENET_TRD2_P, ENET_TRD3_N, ENET_TRD3_P
differential pair: D_PCIE0_TX0_N, D_PCIE0_TX0_P, D_PCIE0_TX1_N, D_PCIE0_TX1_P, D_PCIE0_TX2_N, D_PCIE0_TX2_P, D_PCIE0_TX3_N, D_PCIE0_TX3_P, ENET_TRD0_N, ENET_TRD0_P, ENET_TRD1_N, ENET_TRD1_P, ENET_TRD2_N, ENET_TRD2_P, ENET_TRD3_N, ENET_TRD3_P, PCIE0_CLK_N, PCIE0_CLK_P, PCIE0_RX0_N, PCIE0_RX0_P, PCIE0_RX1_N, PCIE0_RX1_P, PCIE0_RX2_N, PCIE0_RX2_P, PCIE0_RX3_N, PCIE0_RX3_P, PCIE0_TX0_N, PCIE0_TX0_P, PCIE0_TX1_N, PCIE0_TX1_P, PCIE0_TX2_N, PCIE0_TX2_P, PCIE0_TX3_N, PCIE0_TX3_P
net class Z_85: D_PCIE0_TX0_N, D_PCIE0_TX0_P, D_PCIE0_TX1_N, D_PCIE0_TX1_P, D_PCIE0_TX2_N, D_PCIE0_TX2_P, D_PCIE0_TX3_N, D_PCIE0_TX3_P, PCIE0_CLK_N, PCIE0_CLK_P, PCIE0_RX0_N, PCIE0_RX0_P, PCIE0_RX1_N, PCIE0_RX1_P, PCIE0_RX2_N, PCIE0_RX2_P, PCIE0_RX3_N, PCIE0_RX3_P, PCIE0_TX0_N, PCIE0_TX0_P, PCIE0_TX1_N, PCIE0_TX1_P, PCIE0_TX2_N, PCIE0_TX2_P, PCIE0_TX3_N, PCIE0_TX3_P

### Notes on the sheet
- Ethernet interface
- Title
- Size:
- Date:
- A3
- Number:
- Time:
- Revision:
- Sheet
- of
- Go360.io
- File:
- (in symbol WE_7499111447) Y; G

### Library data of the parts
C13 = C_10n_0402: MLCC SMT Capacitor 10 nF 0402; Manufacturer: AVX; PartSymbol: 04025G103ZAT2A; PartNumber: C_10n_0402; Value: 10n
C14 = C_100p_0805: MLCC SMT Capacitor 100pF 0805; Manufacturer: AVX; PartSymbol: 08051A101JAT2A; PartNumber: C_100p_0805; Value: 100p
C46 C81 C83 C84 C86-C90 C92 C94-C96 = C_100n_0402: as C9 on sheet csi; Value: 100n; PartNumber: C_100n_0402
C47 C82 C85 C91 C93 = C_10u_0603: MLCC SMT Capacitor 10uF 0603; Manufacturer: Walsin; PartSymbol: 0603X106M6R3CT; Value: 10u; PartNumber: C_10u_0603
J3 = WE_7499111447: LAN-Transformer WE-RJ45LAN 10/100/1000 BaseT; PartNumber: WE_7499110124; Value: WE_7499110124; PartSymbol: WE_7499110124
J12 = PCIE-064-02-X-D-EMS2-BG: PCI EXPRESS EDGE MOUNT ASSEMBLY; MP: PCIE-064-02-F-D-EMS2-BG; MF: Samtec; Value: *; SnapEDA_Link: https://www.snapeda.com/parts/PCIE-064-02-F-D-EMS2-BG/Samtec/view-part/3370176/?ref=snap; Price: None; Package: None; Availability: Unavailable
R33 = R_10k_0402: RES, 10k, 0402; Manufacturer: MULTICOMP; PartSymbol: MCMR04X1002FTL; Tolerance: 1%; PartNumber: R_10k_0402; Value: 10k
R38 R40 = R_220R_0402: RES, 220R, 0402; Manufacturer: TE CONECTIVITY; PartSymbol: CRG0402J220R; PartNumber: R_220R_0402; Value: 220R
R78 = R_100k_0402: as R119 on sheet ID-Serial; PartNumber: R_100k_0402; Value: 100k
R136-R138 = R_0R_0402: as R13 on sheet csi; Value: 0R; PartNumber: R_0R_0402

## Sheet SoM.SchDoc: Jetson Xavier NX Board
size A3; PageSetup: Record=PageOptions|CenterHorizontal=True|CenterVertical=True|PrintScale=0.97|XCorrection=1.00|YCorrection=1.00|PrintKind=1|BorderSize=5000000|LeftOffset=0|BottomOffset=0|Orientation=2|PaperLength=2970|PaperWidth=2100|Scale=100|PaperSource=7|PrintQuality=600|MediaType=1|DitherType=10|PaperKind=A4|PrintScaleMode=1; Organization: Altium Limited; Address1: 3 Minna Close; Address2: Belrose; Address3: NSW 2085; Address4: Australia; Revision: Rev01
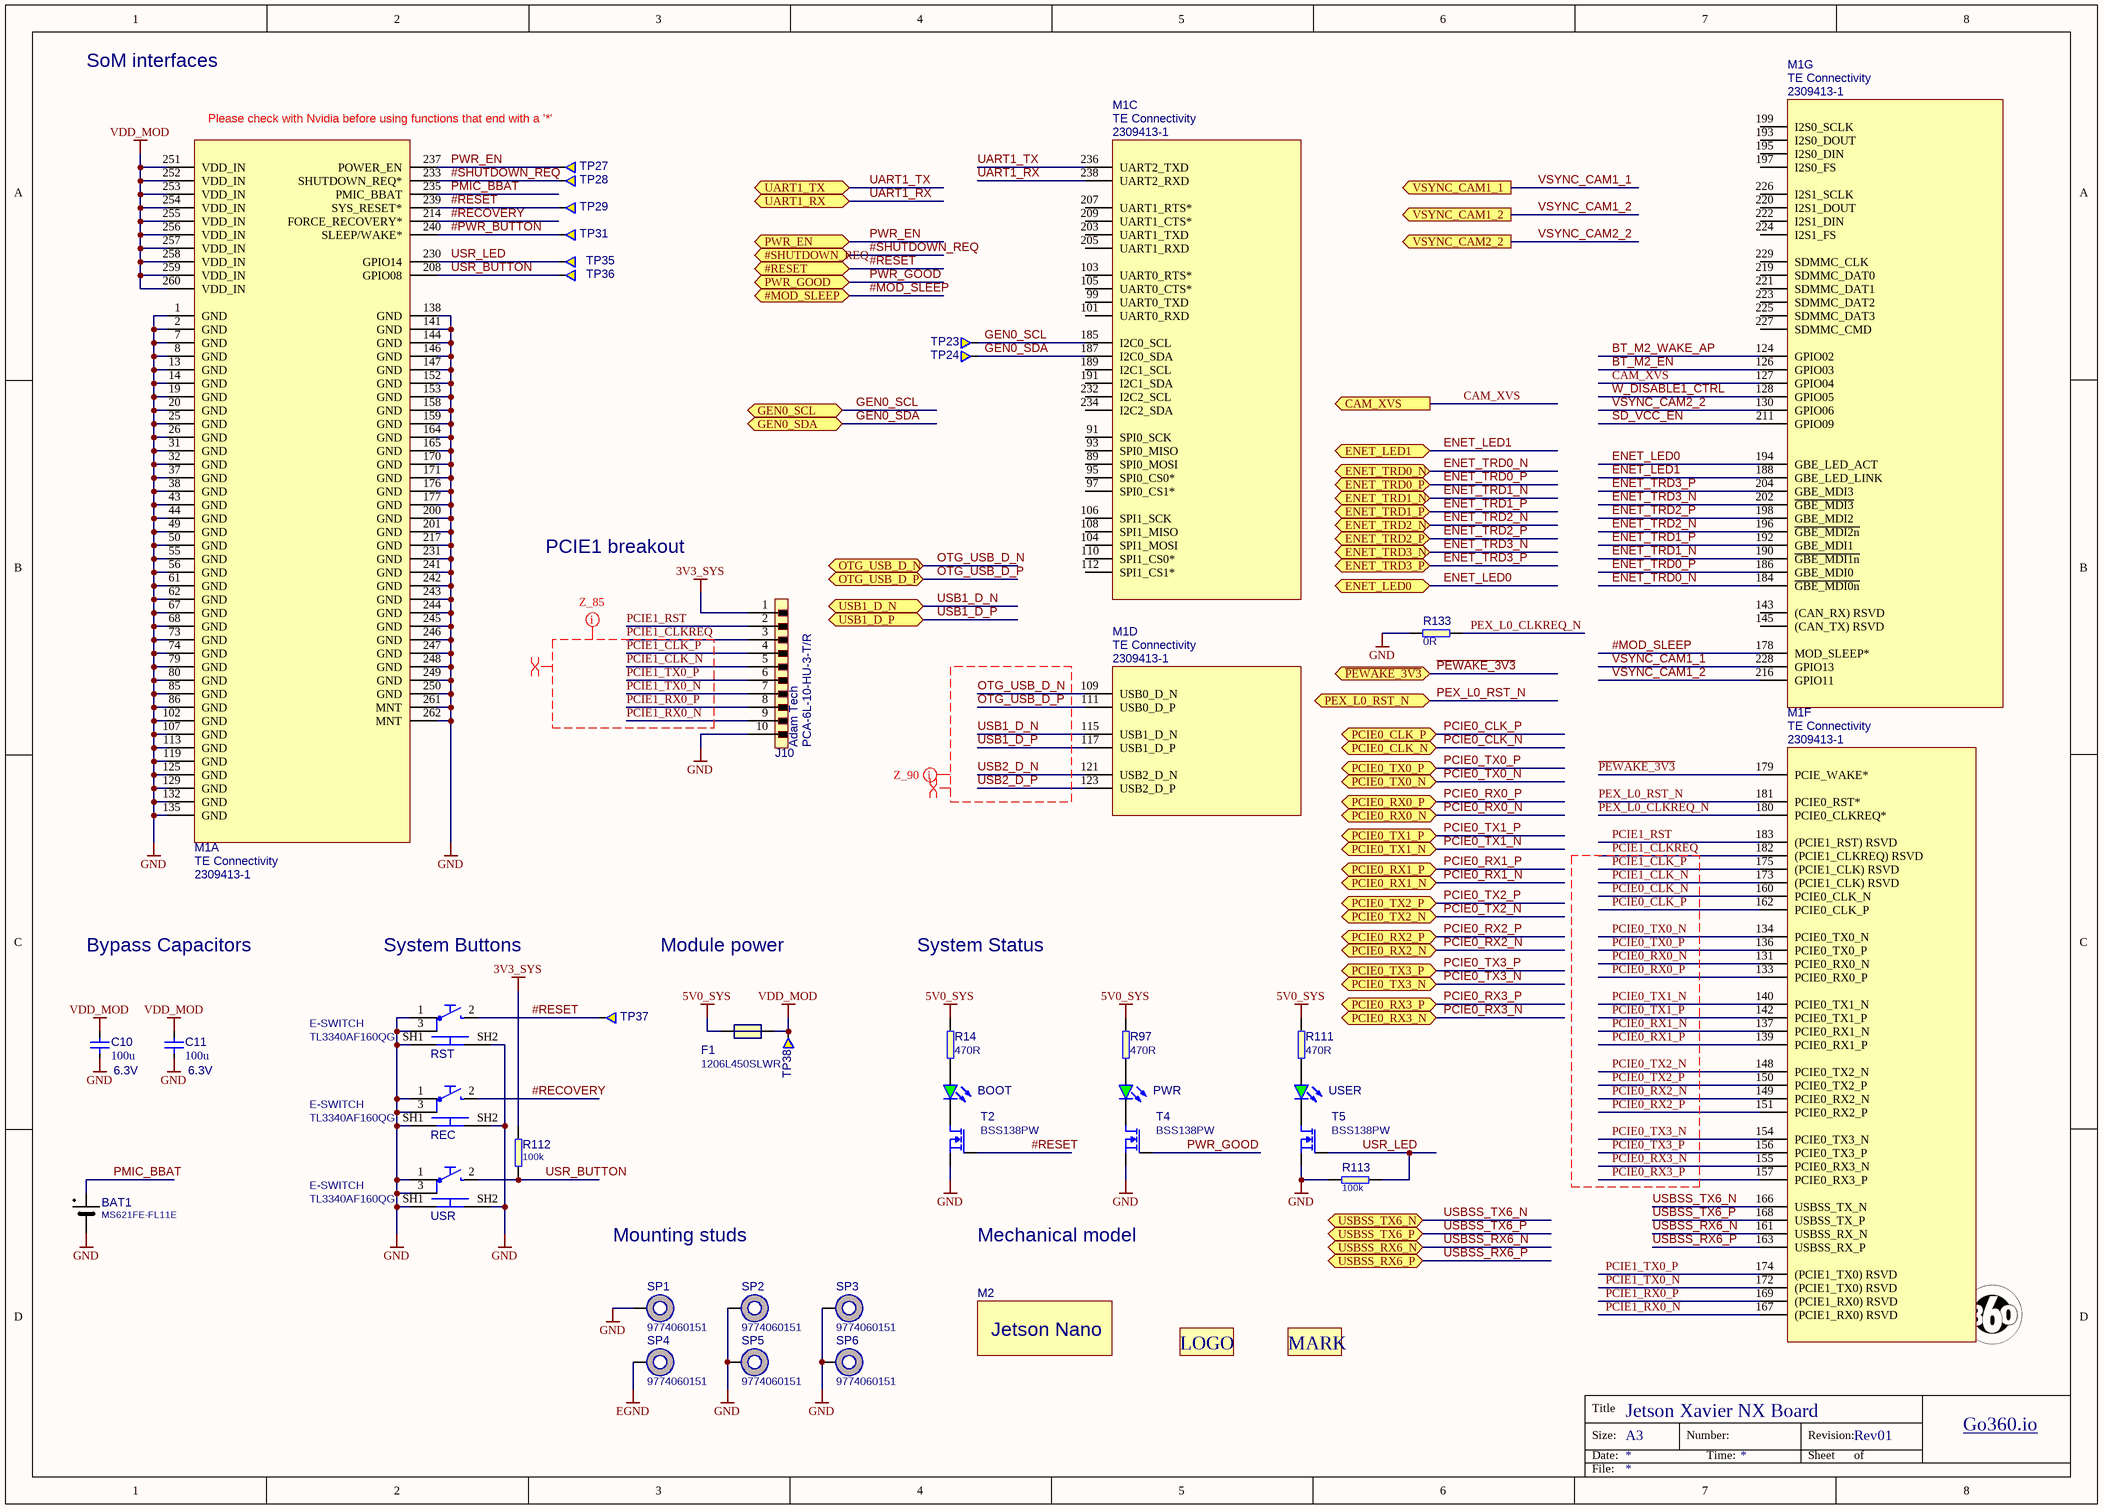
[diagram p4: SoM.SchDoc]

### Parts
(Parts that share a designator on the sheet are numbered #1, #2 ... from top to bottom, then left to right.)
BAT1  MS621FE-FL11E  [MS621FE-FL11E]
BOOT  KPT-1608SGC  [LED0603]  (value not drawn)
C10  Voltage: 6.3V  [1206]  (hidden comment: 100u)
C11  Voltage: 6.3V  [1206]  (hidden comment: 100u)
F1  PartSymbol: 1206L450SLWR  [Fuse-1206]  (hidden comment: Value)
J10  Manufacturer: Adam Tech  [PCA-10]  (hidden comment: PCA-6L-10-HU-3-T/R)
LOGO  LOGO  [LOGO_2]  (value not drawn)
M1#1  Manufacturer: TE Connectivity  [jetson-nano-connector]  (hidden comment: 2309413-1)  (parts A,C,D,F,G of 7)
M2  (no value)  [jetson-nano-module]
MARK  MARK  [MARK]  (value not drawn)
PWR  KPT-1608SGC  [LED0603]  (value not drawn)
R14  470R  [0402]
R97  470R  [0402]
R111  470R  [0402]
R112  100k  [0402]
R113  100k  [0402]
R133  0R  [0402]
REC  Manufacturer: E-SWITCH  [TL3340AF160QG]  (hidden comment: TL3340AF160QG)
RST  Manufacturer: E-SWITCH  [TL3340AF160QG]  (hidden comment: TL3340AF160QG)
SP1  9774060151  [M2.5-6mm]
SP2  9774060151  [M2.5-6mm]
SP3  9774060151  [M2.5-6mm]
SP4  9774060151  [M2.5-6mm]
SP5  9774060151  [M2.5-6mm]
SP6  9774060151  [M2.5-6mm]
T2  BSS138PW  [SC70-3]
T4  BSS138PW  [SC70-3]
T5  BSS138PW  [SC70-3]
TP23  Testpad  [TP-R-1.5]  (value not drawn)  (no BOM)
TP24  Testpad  [TP-R-1.5]  (value not drawn)  (no BOM)
TP27  Testpad  [TP-R-1.5]  (value not drawn)  (no BOM)
TP28  Testpad  [TP-R-1.5]  (value not drawn)  (no BOM)
TP29  Testpad  [TP-R-1.5]  (value not drawn)  (no BOM)
TP31  Testpad  [TP-R-1.5]  (value not drawn)  (no BOM)
TP35  Testpad  [TP-R-1.5]  (value not drawn)  (no BOM)
TP36  Testpad  [TP-R-1.5]  (value not drawn)  (no BOM)
TP37  Testpad  [TP-R-1.5]  (value not drawn)  (no BOM)
TP38  Testpad  [TP-R-1.5]  (value not drawn)  (no BOM)
USER  KPT-1608SGC  [LED0603]  (value not drawn)
USR  Manufacturer: E-SWITCH  [TL3340AF160QG]  (hidden comment: TL3340AF160QG)

### Ports
#MOD_SLEEP, #RESET, #SHUTDOWN_REQ, CAM_XVS (out), ENET_LED0, ENET_LED1, ENET_TRD0_N, ENET_TRD0_P, ENET_TRD1_N, ENET_TRD1_P, ENET_TRD2_N, ENET_TRD2_P, ENET_TRD3_N, ENET_TRD3_P, GEN0_SCL, GEN0_SDA, OTG_USB_D_N, OTG_USB_D_P, PCIE0_CLK_N, PCIE0_CLK_P, PCIE0_RX0_N, PCIE0_RX0_P, PCIE0_RX1_N, PCIE0_RX1_P, PCIE0_RX2_N, PCIE0_RX2_P, PCIE0_RX3_N, PCIE0_RX3_P, PCIE0_TX0_N, PCIE0_TX0_P, PCIE0_TX1_N, PCIE0_TX1_P, PCIE0_TX2_N, PCIE0_TX2_P, PCIE0_TX3_N, PCIE0_TX3_P, PEX_L0_RST_N, PWR_EN, PWR_GOOD, UART1_RX, UART1_TX, USB1_D_N, USB1_D_P, USBSS_RX6_N, USBSS_RX6_P, USBSS_TX6_N, USBSS_TX6_P, VSYNC_CAM1_1 (out), VSYNC_CAM1_2 (out), VSYNC_CAM2_2 (out), ~{PEWAKE_3V3}

### Nets
3V3_SYS: J10.1 R112.2
5V0_SYS: F1.1 R14.2 R97.2 R111.2
EGND: SP4.1
GND: BAT1.- C10.1 C11.1 J10.10 M1#1.1(GND) M1#1.2(GND) M1#1.7(GND) M1#1.8(GND) M1#1.13(GND) M1#1.14(GND) M1#1.19(GND) M1#1.20(GND) M1#1.25(GND) M1#1.26(GND) M1#1.31(GND) M1#1.32(GND) M1#1.37(GND) M1#1.38(GND) M1#1.43(GND) M1#1.44(GND) M1#1.49(GND) M1#1.50(GND) M1#1.55(GND) M1#1.56(GND) M1#1.61(GND) M1#1.62(GND) M1#1.67(GND) M1#1.68(GND) M1#1.73(GND) M1#1.74(GND) M1#1.79(GND) M1#1.80(GND) M1#1.85(GND) M1#1.86(GND) M1#1.102(GND) M1#1.107(GND) M1#1.113(GND) M1#1.119(GND) M1#1.125(GND) M1#1.129(GND) M1#1.132(GND) M1#1.135(GND) M1#1.138(GND) M1#1.141(GND) M1#1.144(GND) M1#1.146(GND) M1#1.147(GND) M1#1.152(GND) M1#1.153(GND) M1#1.158(GND) M1#1.159(GND) M1#1.164(GND) M1#1.165(GND) M1#1.170(GND) M1#1.171(GND) M1#1.176(GND) M1#1.177(GND) M1#1.200(GND) M1#1.201(GND) M1#1.217(GND) M1#1.231(GND) M1#1.241(GND) M1#1.242(GND) M1#1.243(GND) M1#1.244(GND) M1#1.245(GND) M1#1.246(GND) M1#1.247(GND) M1#1.248(GND) M1#1.249(GND) M1#1.250(GND) M1#1.261(MNT) M1#1.262(MNT) R113.2 R133.2 REC.1 REC.3 REC.SH1 REC.SH2 RST.1 RST.3 RST.SH1 RST.SH2 SP1.1 SP2.1 SP3.1 SP5.1 SP6.1 T2.2(S) T4.2(S) T5.2(S) USR.1 USR.3 USR.SH1 USR.SH2
VDD_MOD: C10.2 C11.2 F1.2 M1#1.251(VDD_IN) M1#1.252(VDD_IN) M1#1.253(VDD_IN) M1#1.254(VDD_IN) M1#1.255(VDD_IN) M1#1.256(VDD_IN) M1#1.257(VDD_IN) M1#1.258(VDD_IN) M1#1.259(VDD_IN) M1#1.260(VDD_IN) TP38.1
#MOD_SLEEP: M1#1.178(MOD_SLEEP*) ; port #MOD_SLEEP
#PWR_BUTTON: M1#1.240(SLEEP/WAKE*) TP31.1
#RECOVERY: M1#1.214(FORCE_RECOVERY*) REC.2
#RESET: M1#1.239(SYS_RESET*) RST.2 T2.1(G) TP29.1 TP37.1 ; port #RESET
#SHUTDOWN_REQ: M1#1.233(SHUTDOWN_REQ*) TP28.1 ; port #SHUTDOWN_REQ
~{PEWAKE_3V3}: M1#1.179(PCIE_WAKE*) ; port ~{PEWAKE_3V3}
BT_M2_EN: M1#1.126(GPIO03)
BT_M2_WAKE_AP: M1#1.124(GPIO02)
CAM_XVS: M1#1.127(GPIO04) ; port CAM_XVS
ENET_LED0: M1#1.194(GBE_LED_ACT) ; port ENET_LED0
ENET_LED1: M1#1.188(GBE_LED_LINK) ; port ENET_LED1
ENET_TRD0_N: M1#1.184(~{GBE_MDI0n}) ; port ENET_TRD0_N
ENET_TRD0_P: M1#1.186(GBE_MDI0) ; port ENET_TRD0_P
ENET_TRD1_N: M1#1.190(~{GBE_MDI1n}) ; port ENET_TRD1_N
ENET_TRD1_P: M1#1.192(GBE_MDI1) ; port ENET_TRD1_P
ENET_TRD2_N: M1#1.196(~{GBE_MDI2n}) ; port ENET_TRD2_N
ENET_TRD2_P: M1#1.198(GBE_MDI2) ; port ENET_TRD2_P
ENET_TRD3_N: M1#1.202(~{GBE_MDI3}) ; port ENET_TRD3_N
ENET_TRD3_P: M1#1.204(GBE_MDI3) ; port ENET_TRD3_P
GEN0_SCL: M1#1.185(I2C0_SCL) TP23.1 ; port GEN0_SCL
GEN0_SDA: M1#1.187(I2C0_SDA) TP24.1 ; port GEN0_SDA
OTG_USB_D_N: M1#1.109(USB0_D_N) ; port OTG_USB_D_N
OTG_USB_D_P: M1#1.111(USB0_D_P) ; port OTG_USB_D_P
PCIE0_CLK_N: M1#1.160(PCIE0_CLK_N) ; port PCIE0_CLK_N
PCIE0_CLK_P: M1#1.162(PCIE0_CLK_P) ; port PCIE0_CLK_P
PCIE0_RX0_N: M1#1.131(PCIE0_RX0_N) ; port PCIE0_RX0_N
PCIE0_RX0_P: M1#1.133(PCIE0_RX0_P) ; port PCIE0_RX0_P
PCIE0_RX1_N: M1#1.137(PCIE0_RX1_N) ; port PCIE0_RX1_N
PCIE0_RX1_P: M1#1.139(PCIE0_RX1_P) ; port PCIE0_RX1_P
PCIE0_RX2_N: M1#1.149(PCIE0_RX2_N) ; port PCIE0_RX2_N
PCIE0_RX2_P: M1#1.151(PCIE0_RX2_P) ; port PCIE0_RX2_P
PCIE0_RX3_N: M1#1.155(PCIE0_RX3_N) ; port PCIE0_RX3_N
PCIE0_RX3_P: M1#1.157(PCIE0_RX3_P) ; port PCIE0_RX3_P
PCIE0_TX0_N: M1#1.134(PCIE0_TX0_N) ; port PCIE0_TX0_N
PCIE0_TX0_P: M1#1.136(PCIE0_TX0_P) ; port PCIE0_TX0_P
PCIE0_TX1_N: M1#1.140(PCIE0_TX1_N) ; port PCIE0_TX1_N
PCIE0_TX1_P: M1#1.142(PCIE0_TX1_P) ; port PCIE0_TX1_P
PCIE0_TX2_N: M1#1.148(PCIE0_TX2_N) ; port PCIE0_TX2_N
PCIE0_TX2_P: M1#1.150(PCIE0_TX2_P) ; port PCIE0_TX2_P
PCIE0_TX3_N: M1#1.154(PCIE0_TX3_N) ; port PCIE0_TX3_N
PCIE0_TX3_P: M1#1.156(PCIE0_TX3_P) ; port PCIE0_TX3_P
PCIE1_CLK_N: J10.5 M1#1.173((PCIE1_CLK)_RSVD)
PCIE1_CLK_P: J10.4 M1#1.175((PCIE1_CLK)_RSVD)
PCIE1_CLKREQ: J10.3 M1#1.182((PCIE1_CLKREQ)_RSVD)
PCIE1_RST: J10.2 M1#1.183((PCIE1_RST)_RSVD)
PCIE1_RX0_N: J10.9 M1#1.167((PCIE1_RX0)_RSVD)
PCIE1_RX0_P: J10.8 M1#1.169((PCIE1_RX0)_RSVD)
PCIE1_TX0_N: J10.7 M1#1.172((PCIE1_TX0)_RSVD)
PCIE1_TX0_P: J10.6 M1#1.174((PCIE1_TX0)_RSVD)
PEX_L0_CLKREQ_N: M1#1.180(PCIE0_CLKREQ*) R133.1
PEX_L0_RST_N: M1#1.181(PCIE0_RST*) ; port PEX_L0_RST_N
PMIC_BBAT: BAT1.+ M1#1.235(PMIC_BBAT)
PWR_EN: M1#1.237(POWER_EN) TP27.1 ; port PWR_EN
PWR_GOOD: T4.1(G) ; port PWR_GOOD
~{SD_VCC_EN}: M1#1.211(GPIO09)
UART1_RX: M1#1.238(UART2_RXD) ; port UART1_RX
UART1_TX: M1#1.236(UART2_TXD) ; port UART1_TX
USB1_D_N: M1#1.115(USB1_D_N) ; port USB1_D_N
USB1_D_P: M1#1.117(USB1_D_P) ; port USB1_D_P
USB2_D_N: M1#1.121(USB2_D_N)
USB2_D_P: M1#1.123(USB2_D_P)
USBSS_RX6_N: M1#1.161(USBSS_RX_N) ; port USBSS_RX6_N
USBSS_RX6_P: M1#1.163(USBSS_RX_P) ; port USBSS_RX6_P
USBSS_TX6_N: M1#1.166(USBSS_TX_N) ; port USBSS_TX6_N
USBSS_TX6_P: M1#1.168(USBSS_TX_P) ; port USBSS_TX6_P
USR_BUTTON: M1#1.208(GPIO08) R112.1 TP36.1 USR.2
USR_LED: M1#1.230(GPIO14) R113.1 T5.1(G) TP35.1
VSYNC_CAM1_1: M1#1.228(GPIO13) ; port VSYNC_CAM1_1
VSYNC_CAM1_2: M1#1.216(GPIO11) ; port VSYNC_CAM1_2
VSYNC_CAM2_2: M1#1.130(GPIO06) ; port VSYNC_CAM2_2
W_DISABLE1_CTRL: M1#1.128(GPIO05)
NetBOOT_A: BOOT.A R14.1
NetBOOT_K: BOOT.K T2.3(D)
NetPWR_A: PWR.A R97.1
NetPWR_K: PWR.K T4.3(D)
NetR111_1: R111.1 USER.A
NetT5_3: T5.3(D) USER.K

Not connected (* = marked no-connect by the designer): M1#1 89(SPI0_MOSI) 91(SPI0_SCK) 93(SPI0_MISO) 95(SPI0_CS0*) 97(SPI0_CS1*) 99(UART0_TXD) 101(UART0_RXD) 103(UART0_RTS*) 104(SPI1_MOSI) 105(UART0_CTS*) 106(SPI1_SCK) 108(SPI1_MISO) 110(SPI1_CS0*) 112(SPI1_CS1*) 143((CAN_RX)_RSVD) 145((CAN_TX)_RSVD) 189(I2C1_SCL) 191(I2C1_SDA) 193(I2S0_DOUT) 195(I2S0_DIN) 197(I2S0_FS) 199(I2S0_SCLK) 203(UART1_TXD) 205(UART1_RXD) 207(UART1_RTS*) 209(UART1_CTS*) 219(SDMMC_DAT0) 220(I2S1_DOUT) 221(SDMMC_DAT1) 222(I2S1_DIN) 223(SDMMC_DAT2) 224(I2S1_FS) 225(SDMMC_DAT3) 226(I2S1_SCLK) 227(SDMMC_CMD) 229(SDMMC_CLK) 232(I2C2_SCL) 234(I2C2_SDA)

### Layout directives
differential pair: OTG_USB_D_N, OTG_USB_D_P, PCIE1_CLK_N, PCIE1_CLK_P, PCIE1_CLKREQ, PCIE1_RX0_N, PCIE1_RX0_P, PCIE1_TX0_N, PCIE1_TX0_P, USB1_D_N, USB1_D_P, USB2_D_N, USB2_D_P
net class Z_90: OTG_USB_D_N, OTG_USB_D_P, USB1_D_N, USB1_D_P, USB2_D_N, USB2_D_P
net class Z_85: PCIE1_CLK_N, PCIE1_CLK_P, PCIE1_CLKREQ, PCIE1_RX0_N, PCIE1_RX0_P, PCIE1_TX0_N, PCIE1_TX0_P

### Notes on the sheet
- SoM interfaces
- PCIE1 breakout
- Bypass Capacitors
- System Buttons
- Module power
- System Status
- Mounting studs
- Mechanical model
- Title
- Size:
- Date:
- A3
- Number:
- Time:
- Revision:
- Sheet
- of
- Go360.io
- File:
- (in symbol jetson-nano-module) Jetson Nano
- (in symbol jetson-nano-new-release, part A) Please check with Nvidia before using functions that end with a '*'

### Library data of the parts
BAT1 = battery: Rechargeable Battery, Coin Cell, Single Cell, 3 V, Lithium Manganese Dioxide, 5.5 mAh, Button Cell; Manufacturer: SEIKO INSTRUMENTS; PartNumber: MS621FE-FL11E; Value: MS621FE-FL11E; PartSymbol: MS621FE-FL11E; Class: Battery
BOOT PWR USER = LED: LED Green 0603 case; PartNumber: LED_G; Manufacturer: KINGBRIGHT; Value: KPT-1608SGC; PartSymbol: KPT-1608SGC
C10 C11 = C_100u_1206: MLCC SMT Capacitor 100uF 1206; Manufacturer: KEMET; PartSymbol: C1206C107M9PACTU; PartNumber: C_100u_1206; Value: 100u
F1 = Fuse: PTC RESET 6V LO RHO 1206 4.50A; PartNumber: LITTELFUSE_1206L450SLWR; Manufacturer: LITTELFUSE; Value: 1206L450SLWR
J10 = PCA-10: RECEPTACLE, FPC, ZIF, SMT, 0.5MM, 10WAY, UP; PartNumber: PCA-6K-10-HU-3; Value: PCA-6L-10-HU-3-T/R; PartSymbol: PCA-6L-10-HU-3-T/R
M1#1 = jetson-nano-new-release: PartNumber: 2309413-1; PartSymbol: 2309413-1; Value: 2309413-1
M2 = jetson-nano-module: PartNumber: jetson-nano-module
R14 R97 R111 = R_470R_0402: RES, 470R, 0402; Manufacturer: VISHAY; PartSymbol: CRCW0402470RFKED.; PartNumber: R_470R_0402; Value: 470R
R112 R113 = R_100k_0402: as R119 on sheet ID-Serial; PartNumber: R_100k_0402; Value: 100k
R133 = R_0R_0402: as R13 on sheet csi; Value: 0R; PartNumber: R_0R_0402
REC RST USR = TL3340AF160QG: E-SWITCH  TL3340AF160QG  SWITCH, TACTILE SPST 50mA, SMD GULL WING; Value: TL3340AF160QG; PartNumber: TL3340AF160QG; PartSymbol: TL3340AF160QG
SP1-SP6 = SPACER: M2.5-6mm; PartNumber: M2.5x6; Manufacturer: WURTH ELEKTRONIK; Value: 9774060151; PartSymbol: 9774060151
T2 T4 T5 = NMOS: MOSFET, N CH, 60V, 0.2A; Manufacturer: NXP; Value: BSS138PW; PartNumber: BSS138PW; PartSymbol: BSS138PW
TP23 TP24 TP27-TP29 TP31 TP35-TP38 = Testpad: Testpad, round, 1.5mm; PartNumber: TP-R-1.5

## Sheet supply.SchDoc: Jetson Xavier NX Board
size A3; PageSetup: Record=PageOptions|CenterHorizontal=True|CenterVertical=True|PrintScale=0.97|XCorrection=1.00|YCorrection=1.00|PrintKind=1|BorderSize=5000000|LeftOffset=0|BottomOffset=0|Orientation=2|PaperLength=2970|PaperWidth=2100|Scale=100|PaperSource=7|PrintQuality=600|MediaType=1|DitherType=10|PaperKind=A4|PrintScaleMode=1; Organization: Altium Limited; Address1: 3 Minna Close; Address2: Belrose; Address3: NSW 2085; Address4: Australia; Revision: Rev01
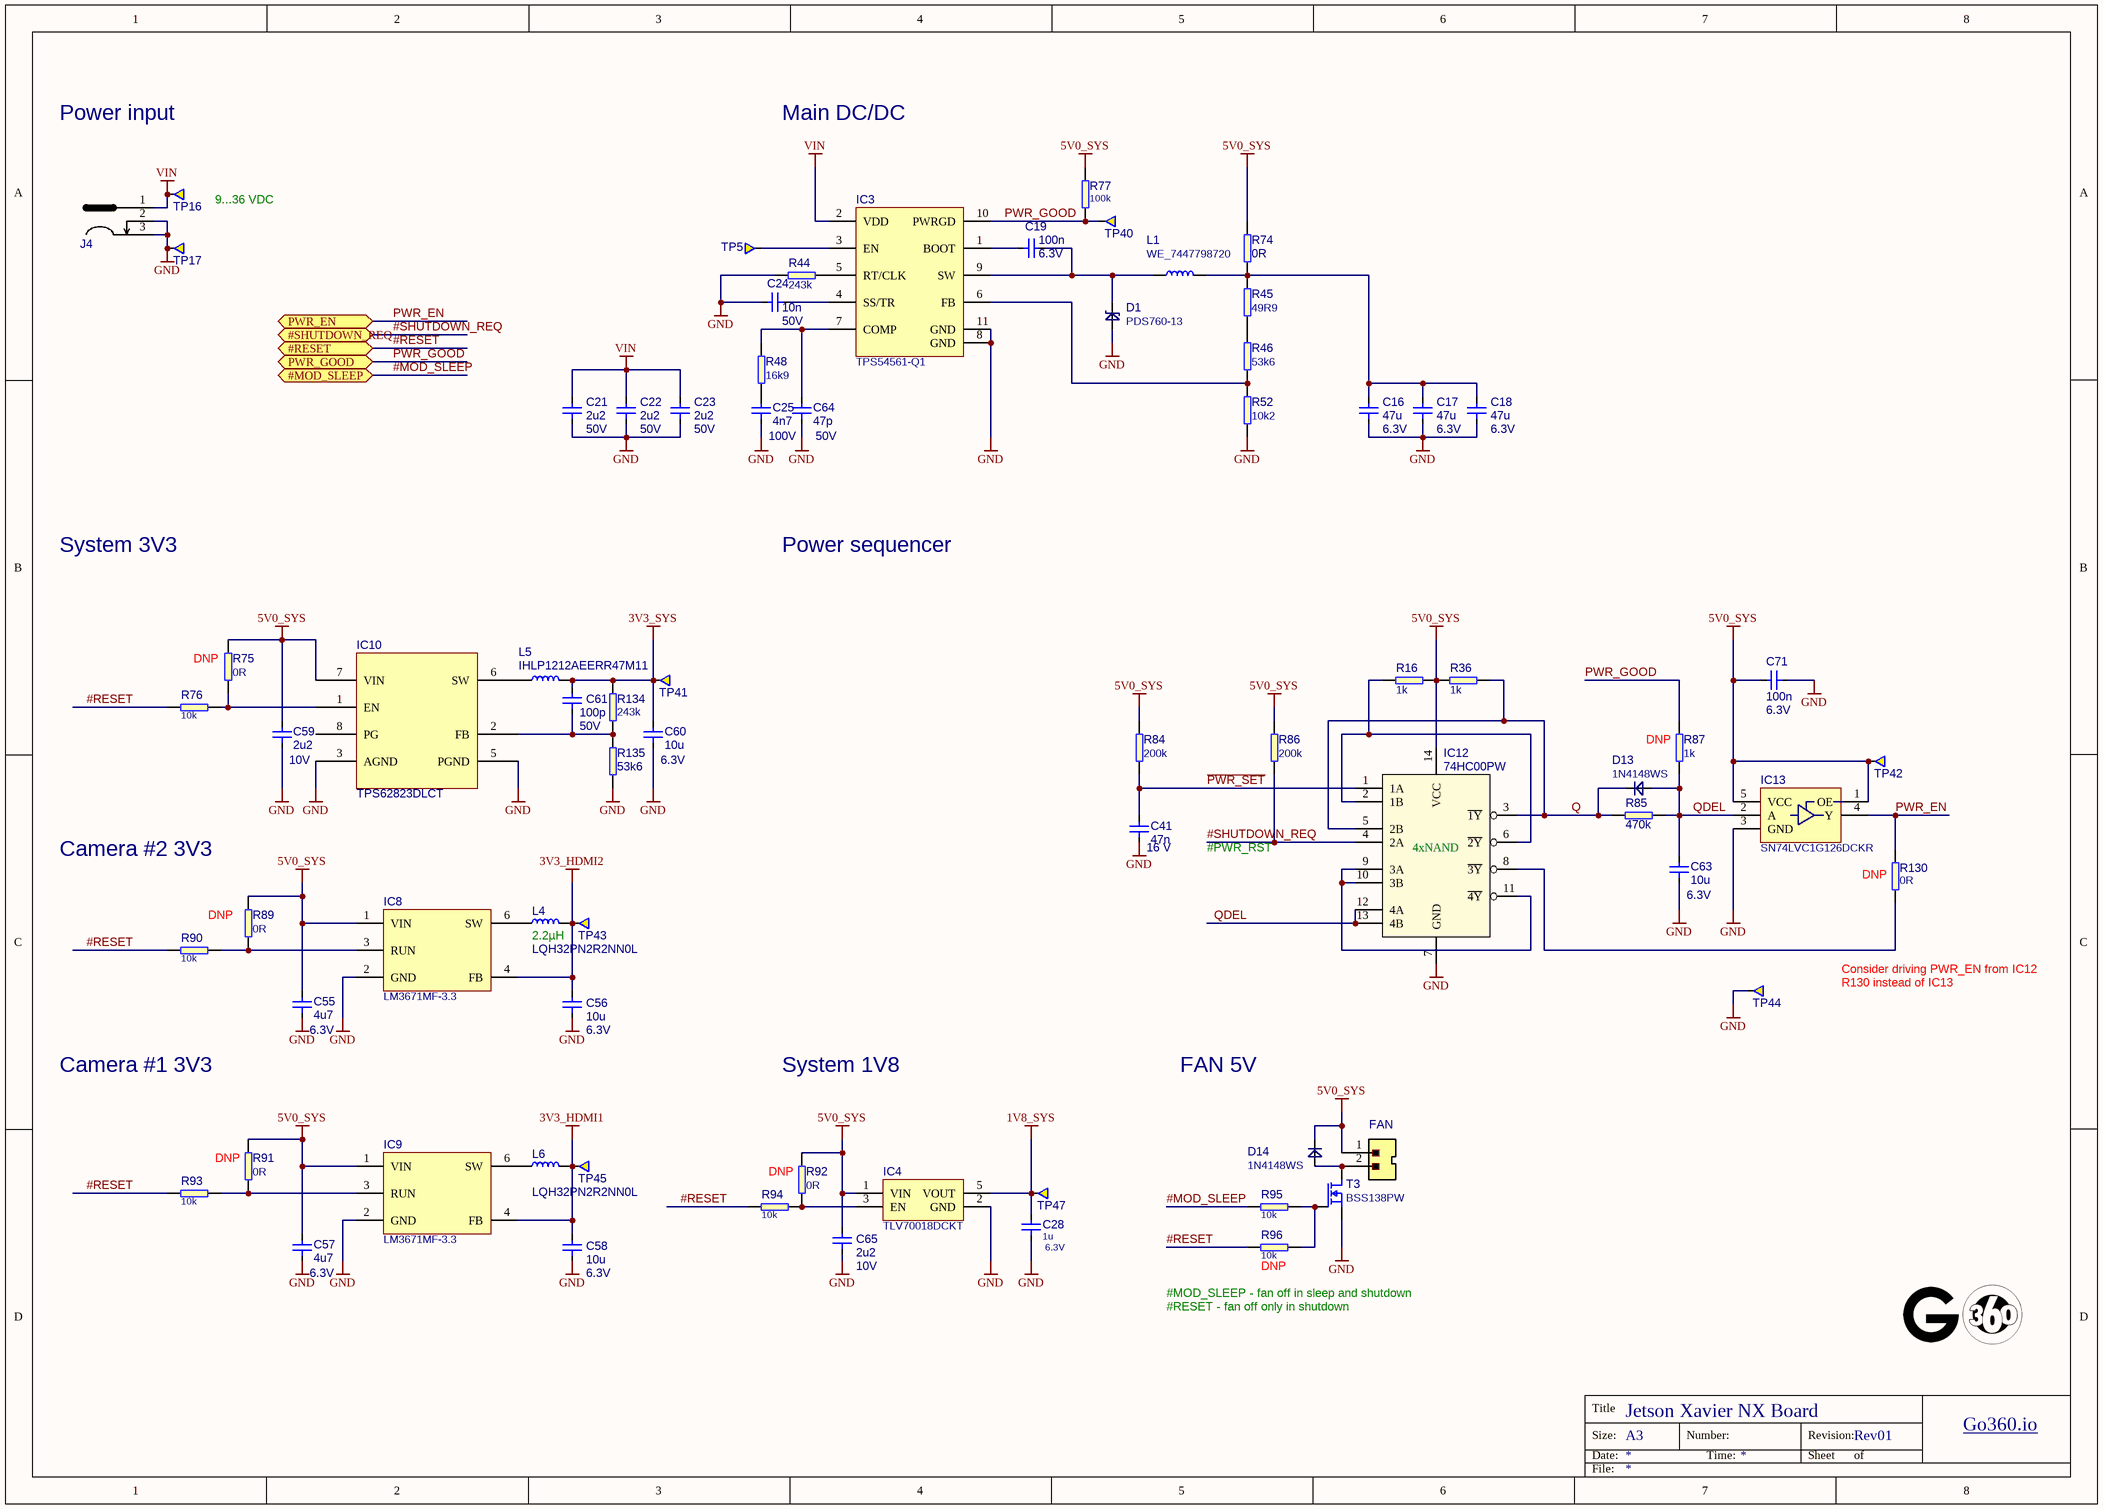
[diagram p5: supply.SchDoc]

### Parts
C16  Voltage: 6.3V  [0805]  (hidden comment: 47u)
C17  Voltage: 6.3V  [0805]  (hidden comment: 47u)
C18  Voltage: 6.3V  [0805]  (hidden comment: 47u)
C19  Voltage: 6.3V  [0402]  (hidden comment: 100n)
C21  Voltage: 50V  [1206]  (hidden comment: 2u2)
C22  Voltage: 50V  [1206]  (hidden comment: 2u2)
C23  Voltage: 50V  [1206]  (hidden comment: 2u2)
C24  Voltage: 50V  [0402]  (hidden comment: 10n)
C25  Voltage: 100V  [0402]  (hidden comment: 4n7)
C28  Voltage: 6.3V  [0402]  (hidden comment: 1u)
C41  Voltage: 16 V  [0402]  (hidden comment: 47n)
C55  Voltage: 6.3V  [0402]  (hidden comment: 4u7)
C56  Voltage: 6.3V  [0603]  (hidden comment: 10u)
C57  Voltage: 6.3V  [0402]  (hidden comment: 4u7)
C58  Voltage: 6.3V  [0603]  (hidden comment: 10u)
C59  Voltage: 10V  [0402]  (hidden comment: 2u2)
C60  Voltage: 6.3V  [0603]  (hidden comment: 10u)
C61  Voltage: 50V  [0402]  (hidden comment: 100p)
C63  Voltage: 6.3V  [0603]  (hidden comment: 10u)
C64  Voltage: 50V  [0402]  (hidden comment: 47p)
C65  Voltage: 10V  [0402]  (hidden comment: 2u2)
C71  Voltage: 6.3V  [0402]  (hidden comment: 100n)
D1  PDS760-13  [PowerDI]
D13  1N4148WS  [SOD-323]
D14  1N4148WS  [SOD-323]
FAN  MX-22-23-2021  [molex_2223-2021]  (value not drawn)
IC3  TPS54561-Q1  [WSON-10_4x4]
IC4  TLV70018DCKT  [SC70-5]
IC8  LM3671MF-3.3  [SOT23-5N]
IC9  LM3671MF-3.3  [SOT23-5N]
IC10  TPS62823DLCT  [TPS62823]
IC12  74HC00PW  [TSSOP-14]
IC13  SN74LVC1G126DCKR  [R-PDSO-G5]
J4  MJ-179PH  [DC_SOCKET]  (value not drawn)
L1  WE_7447798720  [WE_7447798720]
L4  LQH32PN2R2NN0L  [LQH32PN2R2NN0L]
L5  IHLP1212AEERR47M11  [IHLP-1212AE]
L6  LQH32PN2R2NN0L  [LQH32PN2R2NN0L]
R16  1k  [0402]
R36  1k  [0402]
R44  243k  [0402]
R45  49R9  [0402]
R46  53k6  [0402]
R48  16k9  [0402]
R52  10k2  [0402]
R74  0R  [0805]
R75  0R  [0402]
R76  10k  [0402]
R77  100k  [0402]
R84  200k  [0402]
R85  470k  [0402]
R86  200k  [0402]
R87  1k  [0402]
R89  0R  [0402]
R90  10k  [0402]
R91  0R  [0402]
R92  0R  [0402]
R93  10k  [0402]
R94  10k  [0402]
R95  10k  [0402]
R96  10k  [0402]
R130  0R  [0402]
R134  243k  [0402]
R135  53k6  [0402]
T3  BSS138PW  [SC70-3]
TP5  Testpad  [TP-R-1.5]  (value not drawn)  (no BOM)
TP16  Testpad  [TP-R-1.5]  (value not drawn)  (no BOM)
TP17  Testpad  [TP-R-1.5]  (value not drawn)  (no BOM)
TP40  Testpad  [TP-R-1.5]  (value not drawn)  (no BOM)
TP41  Testpad  [TP-R-1.5]  (value not drawn)  (no BOM)
TP42  Testpad  [TP-R-1.5]  (value not drawn)  (no BOM)
TP43  Testpad  [TP-R-1.5]  (value not drawn)  (no BOM)
TP44  Testpad  [TP-R-1.5]  (value not drawn)  (no BOM)
TP45  Testpad  [TP-R-1.5]  (value not drawn)  (no BOM)
TP47  Testpad  [TP-R-1.5]  (value not drawn)  (no BOM)

### Ports
#MOD_SLEEP, #RESET, #SHUTDOWN_REQ, PWR_EN, PWR_GOOD

### Nets
1V8_SYS: C28.2 IC4.5(VOUT) TP47.1
3V3_HDMI1: C58.2 IC9.4(FB) L6.2 TP45.1
3V3_HDMI2: C56.2 IC8.4(FB) L4.2 TP43.1
3V3_SYS: C60.2 C61.2 L5.2 R134.1 TP41.1
5V0_SYS: C55.2 C57.2 C59.2 C65.2 C71.2 D14.C FAN.1 IC4.1(VIN) IC8.1(VIN) IC9.1(VIN) IC10.7(VIN) IC12.14(VCC) IC13.1(OE) IC13.5(VCC) R16.1 R36.2 R74.2 R75.2 R77.2 R84.2 R86.2 R89.2 R91.2 R92.1 TP42.1
GND: C16.1 C17.1 C18.1 C21.1 C22.1 C23.1 C24.2 C25.1 C28.1 C41.1 C55.1 C56.1 C57.1 C58.1 C59.1 C60.1 C63.1 C64.1 C65.1 C71.1 D1.A IC3.8(GND) IC3.11(GND) IC4.2(GND) IC8.2(GND) IC9.2(GND) IC10.3(AGND) IC10.5(PGND) IC12.7(GND) IC13.3(GND) J4.2 J4.3 R44.2 R52.1 R135.1 T3.2(S) TP17.1 TP44.1
VIN: C21.2 C22.2 C23.2 IC3.2(VDD) J4.1 TP16.1
#MOD_SLEEP: R95.2 ; port #MOD_SLEEP
#RESET: R76.2 R90.2 R93.2 R94.2 R96.2 ; port #RESET
#SHUTDOWN_REQ: IC12.4(2A) R86.1 ; port #SHUTDOWN_REQ
~{PWR_SET}: C41.2 IC12.1(1A) R84.1
PWR_EN: IC13.4(Y) R130.1 ; port PWR_EN
PWR_GOOD: IC3.10(PWRGD) R77.1 R87.1 TP40.1 ; port PWR_GOOD
Q: D13.C IC12.3(~{1Y}) IC12.5(2B) R36.1 R85.1
QDEL: C63.2 D13.A IC12.12(4A) IC12.13(4B) IC13.2(A) R85.2 R87.2
NetC16_2: C16.2 C17.2 C18.2 L1.2 R45.2 R74.1
NetC19_1: C19.1 IC3.1(BOOT)
NetC19_2: C19.2 D1.C IC3.9(SW) L1.1
NetC24_1: C24.1 IC3.4(SS/TR)
NetC25_2: C25.2 R48.1
NetC61_1: C61.1 IC10.2(FB) R134.2 R135.2
NetC64_2: C64.2 IC3.7(COMP) R48.2
NetD14_A: D14.A FAN.2 T3.3(D)
NetIC3_3: IC3.3(EN) TP5.1
NetIC3_5: IC3.5(RT/CLK) R44.1
NetIC3_6: IC3.6(FB) R46.1 R52.2
NetIC4_3: IC4.3(EN) R92.2 R94.1
NetIC8_3: IC8.3(RUN) R89.1 R90.1
NetIC8_6: IC8.6(SW) L4.1
NetIC9_3: IC9.3(RUN) R91.1 R93.1
NetIC9_6: IC9.6(SW) L6.1
NetIC10_1: IC10.1(EN) R75.1 R76.1
NetIC10_6: IC10.6(SW) L5.1
NetIC12_2: IC12.2(1B) IC12.6(~{2Y}) R16.2
NetIC12_8: IC12.8(~{3Y}) R130.2
NetIC12_9: IC12.9(3A) IC12.10(3B) IC12.11(~{4Y})
NetR45_1: R45.1 R46.2
NetR95_1: R95.1 R96.1 T3.1(G)

Not connected (* = marked no-connect by the designer): IC10 8(PG)

### Notes on the sheet
- Power input
- Main DC/DC
- 9...36 VDC
- System 3V3
- Power sequencer
- (near R75) DNP
- (near R87) DNP
- Camera #2 3V3
- #PWR_RST
- DNP
- (near R130) DNP
- (near L4) 2.2µH
- R130 instead of IC13
- Consider driving PWR_EN from IC12
- Camera #1 3V3
- System 1V8
- FAN 5V
- (near R91) DNP
- (near R96) #MOD_SLEEP - fan off in sleep and shutdown
- #RESET - fan off only in shutdown
- (near R96) DNP
- Title
- Size:
- Date:
- A3
- Number:
- Time:
- Revision:
- Sheet
- of
- Go360.io
- File:
- (in symbol 74HC00PW) 4xNAND

### Library data of the parts
C16-C18 = C_47u_0805: MLCC SMT Capacitor 47uF 0805; Manufacturer: KEMET; PartSymbol: C0805C476M9PACTU; PartNumber: C_47u_0805; Value: 47u
C19 C71 = C_100n_0402: as C9 on sheet csi; Value: 100n; PartNumber: C_100n_0402
C21-C23 = C_2u2_1206: MLCC SMT Capacitor 2.2uF 1206; Manufacturer: KEMET; PartSymbol: C1206C225J5RACTU; PartNumber: C_2u2_1206; Value: 2u2
C24 = C_10n_0402: as C13 on sheet interfaces; PartNumber: C_10n_0402; Value: 10n
C25 = C_4n7_0402: MLCC SMT Capacitor 4.7 nF 0402; Manufacturer: TDK; PartSymbol: CGA2B3X7S2A472K050BB; PartNumber: C_4n7_0402; Value: 4n7
C28 = C_1u_0402: MLCC SMT Capacitor 1uF 0402; Manufacturer: MULTICOMP; PartSymbol: MC0402F105Z6R3CT; PartNumber: C_1u_0402; Value: 1u
C41 = C_47n_0402: MLCC SMT Capacitor 47nF 0402; Manufacturer: MULTICOMP; PartSymbol: MC0402X473K160CT; PartNumber: C_47n_0402; Value: 47n
C55 C57 = C_4u7_0402: MLCC SMT Capacitor 4.7uF 0402; Manufacturer: MURATA; PartSymbol: GRM155R60J475ME87D; PartNumber: C_4u7_0402; Value: 4u7
C56 C58 C60 C63 = C_10u_0603: as C47 on sheet interfaces; Value: 10u; PartNumber: C_10u_0603
C59 C65 = C_2u2_0402: MLCC SMT Capacitor 2.2uF 0402; Manufacturer: TDK; PartSymbol: C1005X5R1A225K050BC; Value: 2u2; PartNumber: C_2u2_0402
C61 = C_100p_0402: MLCC SMT Capacitor 100pF 0402; Manufacturer: WALSIN; PartSymbol: 0402N101J500CT; PartNumber: C_100p_0402; Value: 100p
C64 = C_47p_0402: MLCC SMT Capacitor 47pF 0402; Manufacturer: KEMET; PartSymbol: C0402C470J5GACTU; PartNumber: C_47p_0402; Value: 47p
D1 = Diode Schottky: DIODE SCHOTTKY 60V 7A POWERDI5; Manufacturer: DIODES INC.; PartNumber: PDS760-13; Value: PDS760-13; PartSymbol: PDS760-13
D13 D14 = diode: as D15 on sheet ID-Serial; PartNumber: 1N4148WS; Value: 1N4148WS; PartSymbol: 1N4148WS
FAN = molex_2223-2021: Pinhead connector with key; Manufacturer: Molex; PartSymbol: 022232021 A-6373-02A222; Value: MX-22-23-2021; PartNumber: molex_2223-2021
IC3 = TPS54561: IC REG BCK SPLIT RAIL ADJ 10WSON; Manufacturer: TEXAS INSTRUMENTS; PartNumber: TPS54561-Q1; Value: TPS54561-Q1; PartSymbol: TPS54561-Q1
IC4 = TLV700: Voltage Regulator, 2V to 5.5V, 175mV Dropout, 1.8Vout, 200mAout; Manufacturer: TEXAS INSTRUMENTS; Value: TLV70018DCKT; PartNumber: TLV70018DCKT; PartSymbol: TLV70018DCKT
IC8 IC9 = LM3671: DC/DC Buck Converter; Manufacturer: TEXAS INSTRUMENTS; PartSymbol: LM3671MF-3.3/NOPB; Value: LM3671MF-3.3; PartNumber: LM3671MF-3.3
IC10 = TPS62823: IC REG BUCK ADJ 1A 8VSON-HR; Manufacturer: TEXAS INSTRUMENTS; PartNumber: TPS62823; Value: TPS62823DLCT; PartSymbol: TPS62823DLCT; Class: IC
IC12 = 74HC00PW: 2 NAND Gate, 4 channel; Manufacturer: NEXPERIA; PartNumber: 74HC00PW; Value: 74HC00PW; PartSymbol: 74HC00PW
IC13 = SN74LVC1G126: Buffer, tri-state; Manufacturer: Texas Instruments; PartNumber: SN74LVC1G126DCKR; Value: SN74LVC1G126DCKR; PartSymbol: SN74LVC1G126DCKR
J4 = DC_SOCKET: DC Power Connector, Jack, 4 A, 1.95 mm, PCB Mount, Through Hole; Manufacturer: MULTICOMP; PartNumber: DC_SOCKET; PartSymbol: MJ-179PH; Value: MJ-179PH
L1 = WE_7447798720: Fixed Inductors WE-PDF 1064 7.2uH 7.9A 12.8mOhm; Manufacturer: WURTH ELEKTRONIK; PartNumber: WE_7447798720; Value: WE_7447798720; PartSymbol: 7447798720; Inductance: 7.2uH; RatedCurrent: 7.9A
L4 L6 = LQH32PN2R2NN0L: INDUCTOR, 2.2 ?H, ? 30%, 1212, 90 MHz, 0.073 ohm; Manufacturer: MURATA; Inductance: 2.2uH; PartNumber: LQH32PN2R2NN0L; Value: LQH32PN2R2NN0L; PartSymbol: LQH32PN2R2NN0L
L5 = IHLP1212AEERR47M11: FIXED IND 470NH 6.7A 15 MOHM SMD; Manufacturer: VISHAY; Class: Inductance; PartNumber: IHLP1212AEERR47M11; Value: IHLP1212AEERR47M11; PartSymbol: IHLP1212AEERR47M11; Inductance: 470nH; RatedCurrent: 6.7A
R16 R36 R87 = R_1k_0402: RES, 1k, 0402; Manufacturer: BOURNS; PartSymbol: CR0402-FX-1001GLF; PartNumber: R_1k_0402; Value: 1k
R44 R134 = R_243k_0402: RES, 243k, 0402; Manufacturer: MULTICOMP; PartSymbol: MCMR04X2433FTL; PartNumber: R_243k_0402; Value: 243k
R45 = R_49R9_0402: RES, 49R9, 0402; Manufacturer: VISHAY; PartSymbol: CRCW040249R9FKED; PartNumber: R_49R9_0402; Value: 49R9
R46 R135 = R_53k6_0402: RES, 53k6, 0402; Manufacturer: TE CONECTIVITY; PartSymbol: CPF0402B53K6E1; PartNumber: R_53k6_0402; Value: 53k6
R48 = R_16k9_0402: RES, 16k9, 0402; Manufacturer: Panasonic; PartSymbol: ERA2AEB1692X; PartNumber: R_16k9_0402; Value: 16k9
R52 = R_10k2_0402: RES, 10k2, 0402, 0.1%; PartNumber: R_10k2_0402_0.1%; Manufacturer: TE CONECTIVITY; PartSymbol: CPF0402B10K2E1; Value: 10k2; Tolerance: 0.1%
R74 = R_0R_0805: RES, 0R, 0805; Manufacturer: BOURNS; PartSymbol: CR0805-J/-000ELF; PartNumber: R_0R_0805; Value: 0R
R75 R89 R91 R92 R130 = R_0R_0402: as R13 on sheet csi; PartNumber: R_0R_0402; Value: 0R
R76 R90 R93-R96 = R_10k_0402: as R33 on sheet interfaces; PartNumber: R_10k_0402; Value: 10k
R77 = R_100k_0402: as R119 on sheet ID-Serial; PartNumber: R_100k_0402; Value: 100k
R84 R86 = R_200k_0402: RES, 200k, 0402; Manufacturer: YAGEO; PartSymbol: RC0402FR-07200KL; PartNumber: R_200k_0402; Value: 200k
R85 = R_470k_0402: SMT Resistor 470k 0402; Manufacturer: VISHAY; PartSymbol: CRCW0402470KFKED; PartNumber: R_470k_0402; Value: 470k
T3 = NMOS: as T2 on sheet SoM; Value: BSS138PW; PartNumber: BSS138PW; PartSymbol: BSS138PW
TP5 TP16 TP17 TP40-TP45 TP47 = Testpad: Testpad, round, 1.5mm; PartNumber: TP-R-1.5